# Altium project SC945D.PrjPcb (part 1 of 2)
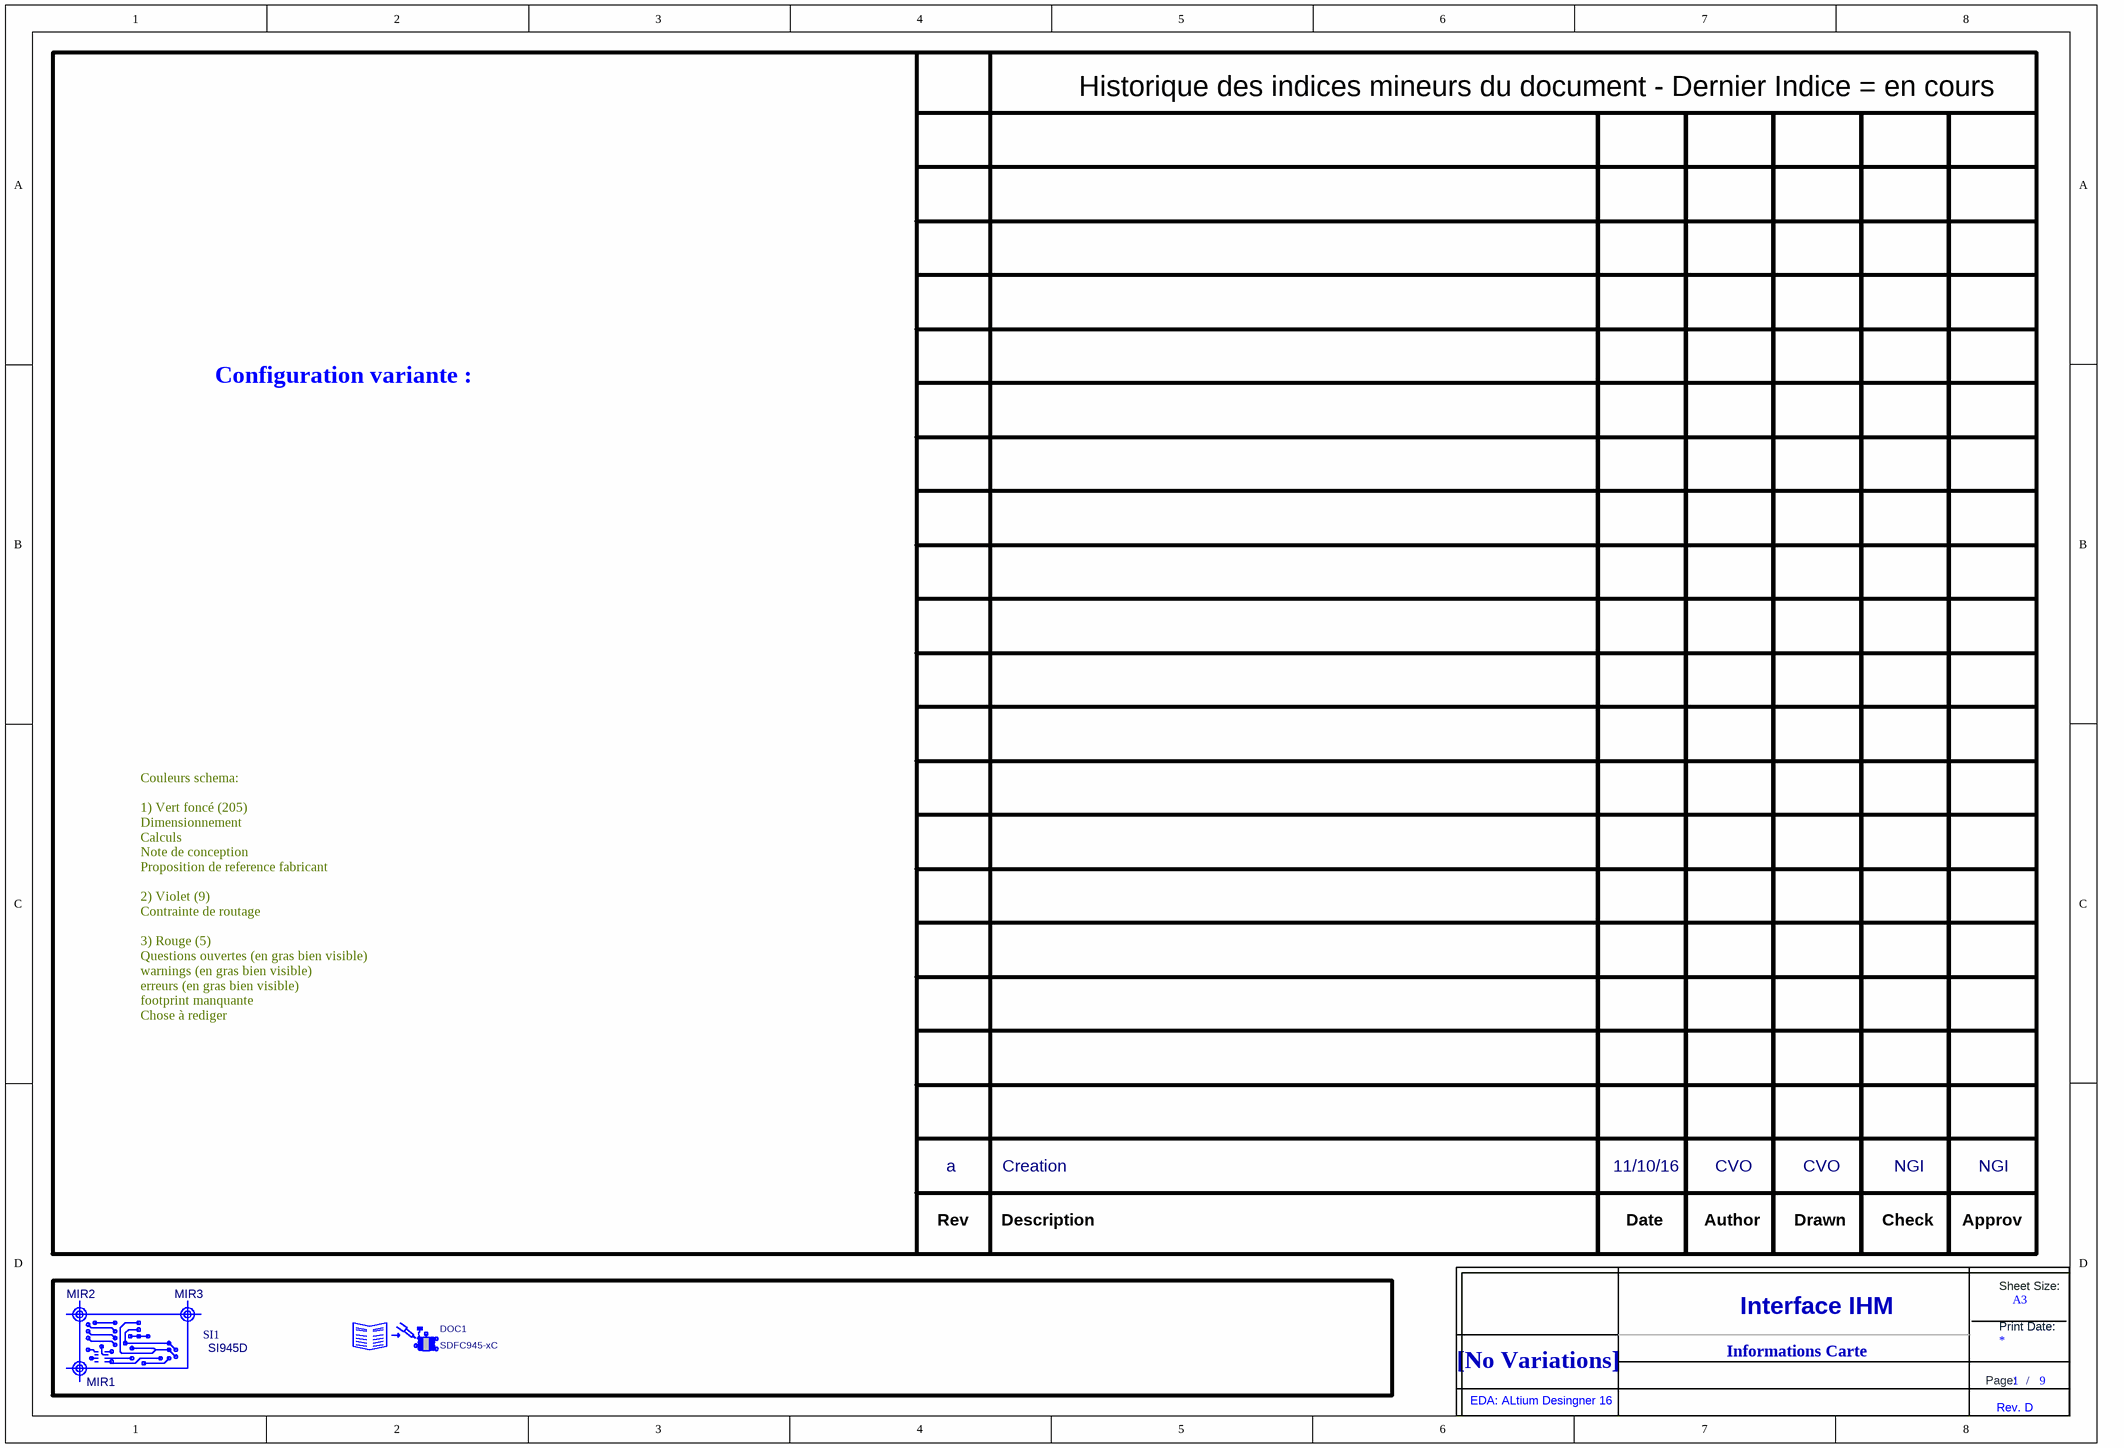
[diagram p0: SC945D_Sommaire.SchDoc]
_Instructions_SC: Les dates et versions mineurs du SDEC (SC) sont à remplir sur la page ..._infos.doc; _Instructions_SI: Les dates et versions mineurs du SI sont à remplir dans la couche "Cartouche TOP"; prjPcbTitle0: Interface IHM; refSI: SI945D; SDECSheetSize: A3; SISheetSize: A3
9 sheets, 180 parts. Net scope: flat (ports and power ports of the same name join across sheets).
Board file: SI945D.PCBDOC
Sheets:
  SC945D_Sommaire.SchDoc
  SC945D_Interface_BP_et_Prog.SchDoc
  SC945D_Alimentations.SchDoc
  SC945D_Micro.SchDoc
  SC945D_SD_Card.SchDoc
  SC945D_Audio.SchDoc
  SC945D_Touchscreen.SchDoc
  SC945D_Backlight.SchDoc
  SC945D_Afficheur.SchDoc

## Sheet SC945D_Sommaire.SchDoc: Informations Carte
size 393 x 270 mm; CompanyName: Seccom; Address1: 521, rue du capt. François Garbit; Address2: 69440 Mornant; Address3: seccom@seccom.fr; Address4: www.seccom.fr; DocumentNumber: 1; SheetNumber: 1; SheetTotal: 9; PageSetup: Record=PageOptions|CenterHorizontal=True|CenterVertical=True|PrintScale=0.74|XCorrection=1.00|YCorrection=1.00|PrintKind=0|BorderSize=5000000|LeftOffset=0|BottomOffset=0|Orientation=2|PaperLength=1000|PaperWidth=1000|Scale=100|PaperSource=7|PrintQuality=-4|MediaType=1|DitherType=10|PaperKind=A4|PrintScaleMode=1

### Parts
(Parts that share a designator on the sheet are numbered #1, #2 ... from top to bottom, then left to right.)
DOC1  Reference: SDFC945-xC  [NULL]  (hidden comment: DOCUMENT_FAB_CARTE_SDFC)
MIR1  MIRE_PICK-N-PLACE  [MIRE_PICK-N-PLACE_D1MM_VE3MM]  (value not drawn)
MIR2  MIRE_PICK-N-PLACE  [MIRE_PICK-N-PLACE_D1MM_VE3MM]  (value not drawn)
MIR3  MIRE_PICK-N-PLACE  [MIRE_PICK-N-PLACE_D1MM_VE3MM]  (value not drawn)
SI1  Reference: SI945D  [CIRCUIT_IMPRIME_SI_STD]
Title_new?#1  DNI  (value not drawn)  (graphical)

### Notes on the sheet
- Historique des indices mineurs du document - Dernier Indice = en cours
- Configuration variante :
- Couleurs schema:
  1) Vert foncé (205)
  Dimensionnement
  Calculs
  Note de conception
  Proposition de reference fabricant
  2) Violet (9)
  Contrainte de routage
  3) Rouge (5)
  Questions ouvertes (en gras bien visible)
  warnings (en gras bien visible)
  erreurs (en gras bien visible)
  footprint manquante
  Chose à rediger
- a
- Creation
- 11/10/16
- CVO
- NGI
- Rev
- Description
- Date
- Author
- Drawn
- Check
- Approv
- Informations Carte
- (in symbol Title_new) Sheet Size:; A3; Interface IHM; Print Date:; [No Variations]; Page:; /; EDA: ALtium Desingner 16; Rev. D

### Library data of the parts
DOC1 = DOCUMENT_FAB_CARTE_SDFC: Document de Fabrication pour la Carte SC{Num SC}-{Version SC}; Creation: LJ; Coeff: 0; Verification: *; Boitier: *; Fabricant: *; Ref Fab: *; Config: *; ComponentLink1URL: http://192.168.0.202/index.php/Accueil; ComponentLink2URL: http://192.168.0.202/index.php/Accueil; ComponentLink1Description: Datasheet; ComponentLink2Description: Datasheet Boitier
MIR1-MIR3 = MIRE_PICK-N-PLACE: Mire pour machine de placement CMS "Pick'n Place"; Creation: LJ (25/10/12); Config: NC; Coeff: 0; Value: *
SI1 = CIRCUIT_IMPRIME_MODEL: Circuit Imprimé; Value: SI945D; Creation: LJ; Verification: LJ (15/11/04); Remarque: {Remarque}; Fabricant: Valentinea; Coeff: 1; Boitier: *; Ref Fab: SI945D; ComponentLink1URL: \\SRV_backup\datasheet\; ComponentLink2URL: \\SRV_backup\datasheet\_BOITIERS\; Config: *; ComponentLink1Description: Datasheet; ComponentLink2Description: Datasheet Boitier
Title_new?#1 = Title_new

## Sheet SC945D_Interface_BP_et_Prog.SchDoc: Interface Boitier Principal & Programmation
size 393 x 270 mm; CompanyName: Seccom; Address1: 521, rue du capt. François Garbit; Address2: 69440 Mornant; Address3: seccom@seccom.fr; Address4: www.seccom.fr; DocumentNumber: 2; SheetNumber: 2; SheetTotal: 9; PageSetup: Record=PageOptions|CenterHorizontal=True|CenterVertical=True|PrintScale=0.74|XCorrection=1.00|YCorrection=1.00|PrintKind=0|BorderSize=5000000|LeftOffset=0|BottomOffset=0|Orientation=2|PaperLength=1000|PaperWidth=1000|Scale=100|PaperSource=7|PrintQuality=-4|MediaType=1|DitherType=10|PaperKind=A4|PrintScaleMode=1
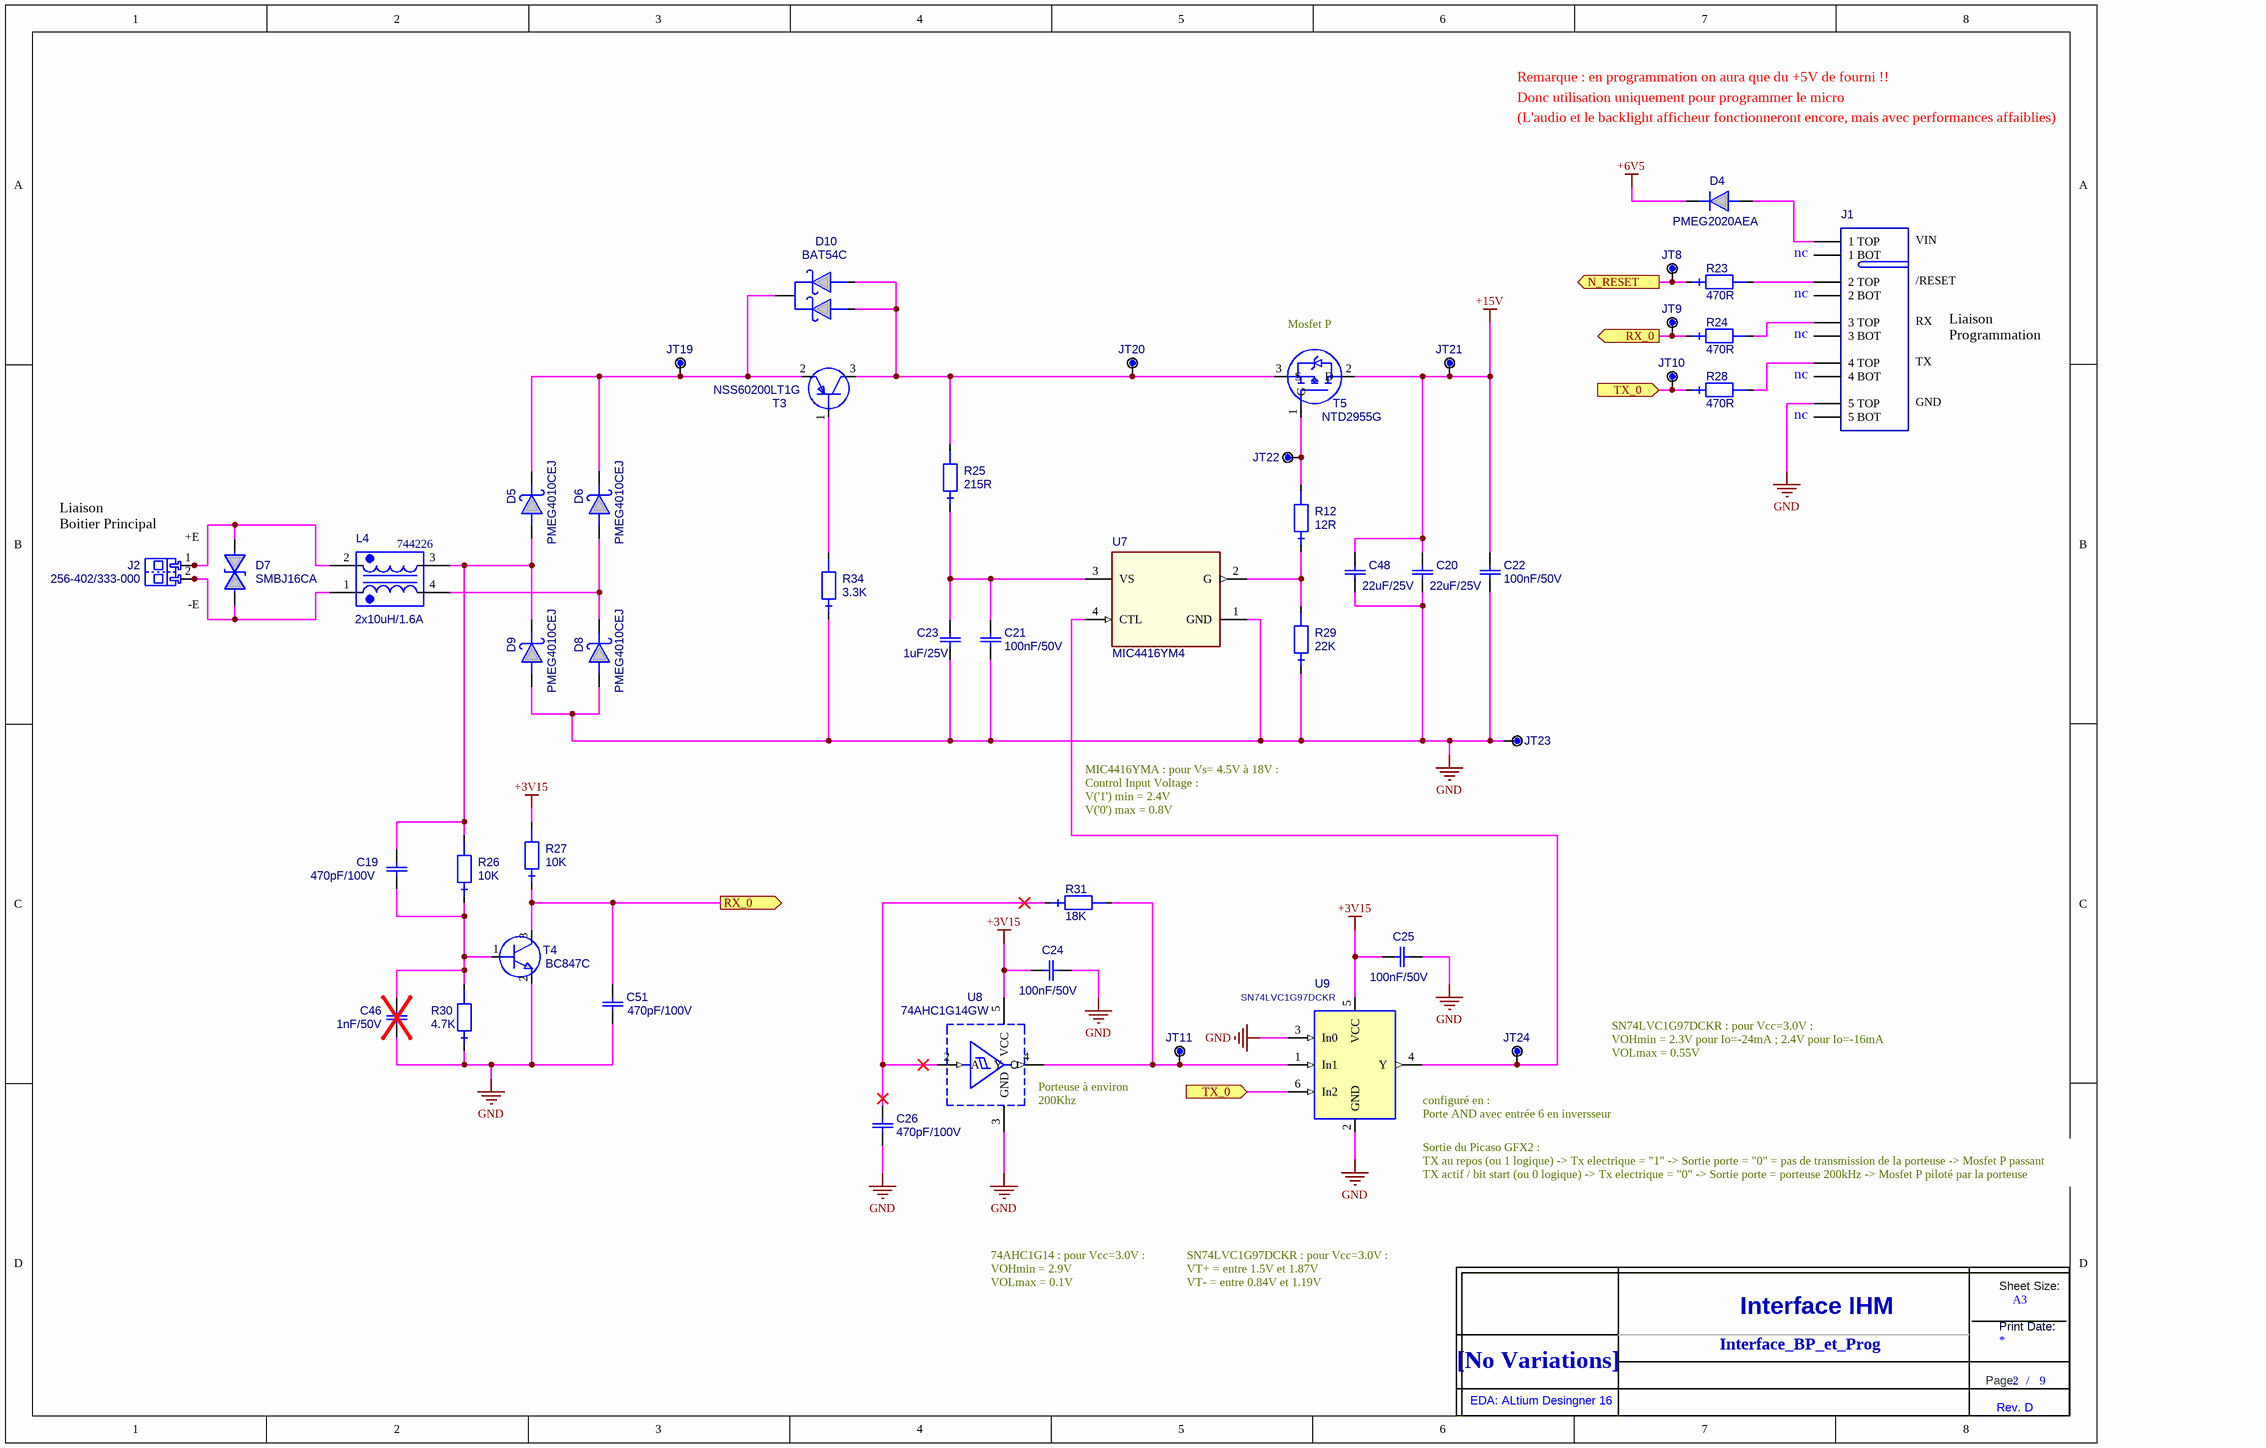
[diagram p1: SC945D_Interface_BP_et_Prog.SchDoc]

### Parts
(Parts that share a designator on the sheet are numbered #1, #2 ... from top to bottom, then left to right.)
C19  value 470pF/100V  [0805_ReflowSoldering_CAP]  (hidden comment: C_0805_NPO_5%_470P-100V)
C20  value 22uF/25V  [1206_ReflowSoldering_CAP]  (hidden comment: C_1206_X5R_20%_22U-25V)
C21  value 100nF/50V  [0603_ReflowSoldering_CAP]  (hidden comment: C_0603_X7R_10%_100N-50V)
C22  value 100nF/50V  [0603_ReflowSoldering_CAP]  (hidden comment: C_0603_X7R_10%_100N-50V)
C23  value 1uF/25V  [0805_ReflowSoldering_CAP]  (hidden comment: C_0805_X5R_10%_1U-25V)
C24  value 100nF/50V  [0603_ReflowSoldering_CAP]  (hidden comment: C_0603_X7R_10%_100N-50V)
C25  value 100nF/50V  [0603_ReflowSoldering_CAP]  (hidden comment: C_0603_X7R_10%_100N-50V)
C26  value 470pF/100V  [0805_ReflowSoldering_CAP]  (hidden comment: C_0805_NPO_5%_470P-100V)
C46  value 1nF/50V  [0603_ReflowSoldering_CAP]  (hidden comment: C_0603_NPO_5%_1N-50V)  (no BOM)
C48  value 22uF/25V  [1206_ReflowSoldering_CAP]  (hidden comment: C_1206_X5R_20%_22U-25V)
C51  value 470pF/100V  [0805_ReflowSoldering_CAP]  (hidden comment: C_0805_NPO_5%_470P-100V)
D4  PMEG2020AEA  [SOD323_ReflowSoldering]
D5  PMEG4010CEJ  [SOD323_ReflowSoldering]
D6  PMEG4010CEJ  [SOD323_ReflowSoldering]
D7  SMBJ16CA  [DO214AA-SMB-NP_ReflowSoldering]
D8  PMEG4010CEJ  [SOD323_ReflowSoldering]
D9  PMEG4010CEJ  [SOD323_ReflowSoldering]
D10  BAT54C  [SOT23_3L_ReflowSoldering]
J1  EMB_ZEC_1893711_HOTE  [EMB_ZEC_1893711_HOTE_NOBOTT]  (value not drawn)  (no BOM)
J2  value 256-402/333-000  [BVIS_02_WAGO_256-402/333-000]  (hidden comment: BLEV_CI_45D_5.08_02_256-402/333-000)
JT8  POINT_TEST_PAD_40MIL  [PAD_CMS_40X40_E]  (value not drawn)  (no BOM)
JT9  POINT_TEST_PAD_40MIL  [PAD_CMS_40X40_E]  (value not drawn)  (no BOM)
JT10  POINT_TEST_PAD_40MIL  [PAD_CMS_40X40_E]  (value not drawn)  (no BOM)
JT11  POINT_TEST_PAD_40MIL  [PAD_CMS_40X40_E]  (value not drawn)  (no BOM)
JT19  POINT_TEST_PAD_40MIL  [PAD_CMS_40X40_E]  (value not drawn)  (no BOM)
JT20  POINT_TEST_PAD_40MIL  [PAD_CMS_40X40_E]  (value not drawn)  (no BOM)
JT21  POINT_TEST_PAD_40MIL  [PAD_CMS_40X40_E]  (value not drawn)  (no BOM)
JT22  POINT_TEST_PAD_40MIL  [PAD_CMS_40X40_E]  (value not drawn)  (no BOM)
JT23  POINT_TEST_PAD_40MIL  [PAD_CMS_40X40_E]  (value not drawn)  (no BOM)
JT24  POINT_TEST_PAD_40MIL  [PAD_CMS_40X40_E]  (value not drawn)  (no BOM)
L4  value 2x10uH/1.6A  Ref Fab: 744226  [SELF_WE-SL2_9.2x6]  (hidden comment: IND_FERRITE_WE-SL2_2X10UH)
R12  value 12R  [0603_ReflowSoldering_RES]  (hidden comment: RES_0603_1%_100PPM_12R)
R23  value 470R  [0603_ReflowSoldering_RES]  (hidden comment: RES_0603_1%_100PPM_470R)
R24  value 470R  [0603_ReflowSoldering_RES]  (hidden comment: RES_0603_1%_100PPM_470R)
R25  value 215R  [0603_ReflowSoldering_RES]  (hidden comment: RES_0603_1%_100PPM_215R)
R26  value 10K  [0603_ReflowSoldering_RES]  (hidden comment: RES_0603_1%_100PPM_10K)
R27  value 10K  [0603_ReflowSoldering_RES]  (hidden comment: RES_0603_1%_100PPM_10K)
R28  value 470R  [0603_ReflowSoldering_RES]  (hidden comment: RES_0603_1%_100PPM_470R)
R29  value 22K  [0603_ReflowSoldering_RES]  (hidden comment: RES_0603_1%_100PPM_22K)
R30  value 4.7K  [0603_ReflowSoldering_RES]  (hidden comment: RES_0603_1%_100PPM_4.7K)
R31  value 18K  [0603_ReflowSoldering_RES]  (hidden comment: RES_0603_1%_100PPM_18K)
R34  value 3.3K  [0603_ReflowSoldering_RES]  (hidden comment: RES_0603_1%_100PPM_3.3K)
T3  NSS60200LT1G  [SOT23_3L_ReflowSoldering]
T4  BC847C  [SOT23_3L_ReflowSoldering]
T5  NTD2955G  [DPAK]
Title_new?#2  DNI  (value not drawn)  (graphical)
U7  MIC4416YM4  [SOT143]
U8  74AHC1G14GW  [SOT353]
U9  value SN74LVC1G97DCKR  [SC70_6]  (hidden comment: 74LVC1G97DCKR)

### Ports
N_RESET (out), RX_0 (out), TX_0 (in)

### Nets
+3V15: C24.2 C25.2 R27.2 U8.5(VCC) U9.5(VCC)
+6V5: D4.K
+15V: C20.2 C22.2 C48.2 JT21.1 T5.2(D)
GND: C20.1 C21.1 C22.1 C23.1 C24.1 C25.1 C26.1 C46.1 C48.1 C51.1 D8.A D9.A J1.5(5_TOP) JT23.1 R29.1 R30.1 R34.1 T4.2(E) U7.1(GND) U8.3(GND) U9.2(GND) U9.3(In0)
N_RESET: JT8.1 R23.1 ; port N_RESET
RX_0: C51.2 JT9.1 R24.1 R27.1 T4.3(C) ; port RX_0
TX_0: JT10.1 R28.1 U9.6(In2) ; port TX_0
NetC19_1: C19.1 C46.2 R26.1 R30.2 T4.1(B)
NetC19_2: C19.2 D5.A D9.K L4.3 R26.2
NetC21_2: C21.2 C23.2 R25.1 U7.3(VS)
NetC26_2: C26.2 R31.1 U8.2(A)
NetD4_A: D4.A J1.1(1_TOP)
NetD5_K: D5.K D6.K D10.3 JT19.1 T3.2(E)
NetD6_A: D6.A D8.K L4.4
NetD7_1: D7.1 J2.2 J2.4 L4.1
NetD7_2: D7.2 J2.1 J2.3 L4.2
NetD10_1: D10.1 D10.2 JT20.1 R25.2 T3.3(C) T5.3(S)
NetJ1_2: J1.2(2_TOP) R23.2
NetJ1_3: J1.3(3_TOP) R24.2
NetJ1_4: J1.4(4_TOP) R28.2
NetJT11_1: JT11.1 R31.2 U8.4(Y) U9.1(In1)
NetJT22_1: JT22.1 R12.2 T5.1(G)
NetJT24_1: JT24.1 U7.4(CTL) U9.4(Y)
NetR12_1: R12.1 R29.2 U7.2(G)
NetR34_2: R34.2 T3.1(B)

Not connected (* = marked no-connect by the designer): J1 6(1_BOT) 7(2_BOT) 8(3_BOT) 9(4_BOT) 10(5_BOT); U8 1

### Notes on the sheet
- Remarque : en programmation on aura que du +5V de fourni !!
- Donc utilisation uniquement pour programmer le micro
- (L'audio et le backlight afficheur fonctionneront encore, mais avec performances affaiblies)
- (near J1) nc
- VIN
- /RESET
- (near T5) Mosfet P
- RX
- TX
- Liaison Programmation
- GND
- (near J2) Liaison
  Boitier Principal
- +E
- -E
- MIC4416YMA : pour Vs= 4.5V à 18V :
  Control Input Voltage :
  V('1') min = 2.4V
  V('0') max = 0.8V
- SN74LVC1G97DCKR : pour Vcc=3.0V :
  VOHmin = 2.3V pour Io=-24mA ; 2.4V pour Io=-16mA
  VOLmax = 0.55V
- (near U8) Porteuse à environ 200Khz
- configuré en :
  Porte AND avec entrée 6 en inversseur
- (near U9) Sortie du Picaso GFX2 :
  TX au repos (ou 1 logique) -> Tx electrique = "1" -> Sortie porte = "0" = pas de transmission de la porteuse -> Mosfet P passant
  TX actif / bit start (ou 0 logique) -> Tx electrique = "0" -> Sortie porte = porteuse 200kHz -> Mosfet P piloté par la porteuse
- 74AHC1G14 : pour Vcc=3.0V :
  VOHmin = 2.9V
  VOLmax = 0.1V
- SN74LVC1G97DCKR : pour Vcc=3.0V :
  VT+ = entre 1.5V et 1.87V
  VT- = entre 0.84V et 1.19V
- Interface_BP_et_Prog
- (in symbol Title_new) Sheet Size:; A3; Interface IHM; Print Date:; [No Variations]; Page:; /; EDA: ALtium Desingner 16; Rev. D

### Library data of the parts
C19 C26 C51 = C_0805_NPO_5%_470P-100V: Condensateur céramique, NPO, 5%, CMS 0805; Creation: EC (30/04/10); Verification: LJ (20/05/10); Reference: 001384/00; Boitier: 0805; Remarque: {Remarque}; Coeff: 1; Fabricant: AVX; Ref Fab: 08051A471JAT2A; ComponentLink1URL: o:\_Documentation\Datasheets\BC_Components\Condo_CMS_NPO-X7R-Y5V.pdf; ComponentLink2URL: o:\_Documentation\Datasheets\_BOITIERS\PASSIF_CMS\RC_0805_(2x1,25)_(Schneider).PDF; Config: *; ComponentLink1Description: Datasheet; ComponentLink2Description: Datasheet Boitier; Supplier 1: Farnell; Supplier 2: Mouser; Supplier Part Number 1: 499195; Supplier Part Number 2: 581-08051A471J
C20 C48 = C_1206_X5R_20%_22U-25V: Condensateur céramique, X5R, 20%, CMS 1206, 22uF/25V; Creation: ZA (18/12/13); Reference: /01; Boitier: 1206; Remarque: {Remarque}; Coeff: 1; Fabricant: TDK; Ref Fab: C3216X5R1E226M160AB; Verification: *; ComponentLink1URL: O:\_Documentation\Datasheets\TDK\general_B11.pdf; ComponentLink2URL: o:\_Documentation\Datasheets\_BOITIERS\PASSIF_CMS\; ComponentLink1Description: Datasheet; ComponentLink2Description: Datasheet Boitier; Supplier 1: Farnell; Supplier Part Number 1: 2354129; Supplier 2: Mouser; Supplier Part Number 2: 810-C3216X5R1E226M
C21 C22 C24 C25 = C_0603_X7R_10%_100N-50V: Condensateur céramique, X7R, 10%, CMS 0603, 100nF/50V; Creation: FB (29/02/12); Boitier: 0603; Remarque: {Remarque}; Fabricant: Kemet; Ref Fab: C0603C104K5RAC; Coeff: 1; ComponentLink1URL: O:\_Documentation\Datasheets\Kemet\Condos_Ceramic_CMS.pdf; ComponentLink2URL: o:\_Documentation\Datasheets\_BOITIERS\PASSIF_CMS\; Config: *; ComponentLink1Description: Datasheet; ComponentLink2Description: Datasheet Boitier; Supplier 1: Farnell; Supplier Part Number 1: 1288255
C23 = C_0805_X5R_10%_1U-25V: Condensateur céramique, X5R, 10%, CMS 0805; Creation: FB (07/03/12); Reference: 001834/00; Boitier: 0805; Remarque: {Remarque}; Coeff: 1; Fabricant: AVX; Ref Fab: 08053D105KAT2A; Verification: *; ComponentLink1URL: O:\_Documentation\Datasheets\AVX\Condensateurs_CMS_Ceramic_X5R.pdf; ComponentLink2URL: o:\_Documentation\Datasheets\_Boitiers\PASSIF_CMS\RC_0805_(2x1,25)_(Schneider).pdf; Config: *; ComponentLink1Description: Datasheet; ComponentLink2Description: Datasheet Boitier; Supplier Part Number 1: 1327695; Supplier Part Number 2: 6983409; Supplier 1: Farnell; Supplier 2: Radiospares
C46 = C_0603_NPO_5%_1N-50V: Condensateur céramique, NPO, 5%, CMS 0603; Creation: LJ; Reference: 001809/00; Boitier: 0603; Remarque: {Remarque}; Coeff: 1; Fabricant: AVX; Ref Fab: 06035A102JAT2A; ComponentLink1URL: o:\_Documentation\Datasheets\BC_Components\Condo_CMS_NPO-X7R-Y5V.pdf; ComponentLink2URL: o:\_Documentation\Datasheets\_BOITIERS\PASSIF_CMS\; Config: *; ComponentLink1Description: Datasheet; ComponentLink2Description: Datasheet Boitier; Supplier 1: Mouser; Supplier Part Number 1: 581-06035A102J
D4 = PMEG2020AEA: Diode Schottky, Vrrm=20V, If=2A, Vf=0.45V, CMS; Creation: PDP (10/07/12); Boitier: SOD323; Remarque: {Remarque}; Coeff: 1; Fabricant: NXP; Verification: *; ComponentLink1URL: o:\_Documentation\Datasheets\NXP\PMEG2020AEA.PDF; ComponentLink2URL: o:\_Documentation\Datasheets\_BOITIERS\ACTIF_CMS\SOD\SOD_80_(MLL34)_(Schneider).PDF; Config: *; ComponentLink1Description: Datasheet; ComponentLink2Description: Datasheet Boitier; Ref Fab: PMEG2020AEA; Value: PMEG2020AEA
D5 D6 D8 D9 = PMEG4010CEJ: Diode Schottky, Vrrm=40V, If=1A, Vf=0.49V, CMS, -65/+150°C; Creation: FB (30/07/13); Boitier: SOD323F; Remarque: {Remarque}; Coeff: 1; Fabricant: NXP; Verification: *; ComponentLink1URL: O:\_Documentation\Datasheets\NXP\PMEG4010CEH_PMEG4010CEJ.pdf; Config: *; ComponentLink1Description: Datasheet; ComponentLink2Description: Datasheet Boitier; Ref Fab: PMEG4010CEJ; Value: PMEG4010CEJ; Supplier 1: Farnell; Supplier Part Number 1: 1757777; Supplier 2: Mouser; Supplier Part Number 2: 771-PMEG4010CEJ-T/R
D7 = SMBJ16CA: Diode Transil/TVS bidirectionnelle (CA), 600W, 16V, CMS, serie SMBJ; Creation: FB (30/07/13); Boitier: DO214AA/SMB; Remarque: {Remarque}; Coeff: 1; Fabricant: Bourns; ComponentLink1URL: O:\_Documentation\Datasheets\Bourns\SMBJ_diodes_TVS_600W.pdf; ComponentLink2URL: o:\_Documentation\Datasheets\_BOITIERS\ACTIF_CMS\SMx\SMB_(Schneider).lnk; Config: *; ComponentLink1Description: Datasheet; ComponentLink2Description: Datasheet Boitier; Ref Fab: SMBJ16CA; Supplier Part Number 1: 652-SMBJ16CA; Supplier 1: Mouser; Value: SMBJ16CA
D10 = BAT54C: Diode Schottky double, BAT54 cathode com, Vrrm=30V, If=300mA, Vf=0.4Vmax, CMS; Creation: LJ (14/05/02); Reference: 000597/00; Boitier: SOT23_3L; Remarque: {Remarque}; Coeff: 1; Fabricant: NXP; Verification: LJ (14/05/02); ComponentLink1URL: O:\_Documentation\Datasheets\NXP\BAT54_series.pdf; ComponentLink2URL: o:\_Documentation\Datasheets\_BOITIERS\ACTIF_CMS\SOT\SOT_23_3P_(Schneider).PDF; Config: *; ComponentLink1Description: Datasheet; ComponentLink2Description: Datasheet Boitier; Ref Fab: BAT54C; Supplier 1: Farnell; Supplier Part Number 1: 1081192; Value: BAT54C
J1 = EMB_ZEC_1893711_HOTE: Implantation CI pour connecteur ZEC 1,0/5-ST-3,5 C1 R1,5 (ref 1893711); Creation: JPL (18/07/12); Fabricant: Phoenix Contact; Coeff: 1; Config: *; ComponentLink1Description: Datasheet; ComponentLink2Description: Datasheet Boitier
J2 = BLEV_CI_45D_5.08_02_256-402/333-000: Bornier à levier pour CI, e5.08, 2pts, 45 degrés, 300V/15A, AWG 28-12, Gris; Creation: LJ; Remarque: {Remarque}; Fabricant: Wago; Coeff: 1; Ref Fab: 256-402/333-000; Config: *; ComponentLink1Description: Datasheet; ComponentLink2Description: Datasheet; Supplier 1: Farnell; Supplier Part Number 1: 1695013
JT8-JT11 JT19-JT24 = POINT_TEST_PAD_40MIL: Point de test sur CI, pad de diamètre 1.016mm (40mils); Creation: FB (04/10/12); Remarque: {Remarque}; Coeff: 1; Value: POINT_TEST; Config: *; ComponentLink1Description: Datasheet; ComponentLink2Description: Datasheet Boitier
L4 = IND_FERRITE_WE-SL2_2X10UH: Filtre double ferrite, 2x10uH, 42Vac/80Vdc, 1.6A, serie WE-SL2, -40/+125°C, CMS; Creation: FB (19/03/12); Boitier: WE-SL2_9.2x6_h5mm; Coeff: 1; Fabricant: Wurth Elektronik; ComponentLink1URL: O:\_Documentation\Datasheets\Wurth_Elektronik\744226.pdf; ComponentLink2URL: o:\_Documentation\Datasheets\_BOITIERS\; Config: *; ComponentLink1Description: Datasheet; ComponentLink2Description: Datasheet Boitier; Supplier Part Number 1: 1636269; Supplier 1: Farnell; Supplier 2: Radiospares; Supplier Part Number 2: 3675045
R12 = RES_0603_1%_100PPM_12R: Résistance, 0.100W, 1%, 100ppm, 75V, 12R; Creation: FB (11/09/12); Boitier: 0603; Remarque: {Remarque}; Fabricant: Vishay; Ref Fab: CRCW060312R0FKEA; Coeff: 1; Verification: *; ComponentLink1URL: O:\_Documentation\Datasheets\Vishay\Resistances_D-CRCWe3.pdf; ComponentLink2URL: o:\_Documentation\Datasheets\_BOITIERS\PASSIF_CMS\; Config: *; ComponentLink1Description: Datasheet; ComponentLink2Description: Datasheet Boitier; Supplier 1: Farnell; Supplier Part Number 1: 1652838; Supplier 2: Mouser; Supplier Part Number 2: 71-CRCW0603-12-E3
R23 R24 R28 = RES_0603_1%_100PPM_470R: Résistance, 0.100W, 1%, 100ppm, 75V, 470R; Creation: FB (29/07/13); Boitier: 0603; Remarque: {Remarque}; Fabricant: Vishay; Ref Fab: CRCW0603470RFKEA; Coeff: 1; Verification: *; ComponentLink1URL: O:\_Documentation\Datasheets\Vishay\Resistances_D-CRCWe3.pdf; ComponentLink2URL: o:\_Documentation\Datasheets\_BOITIERS\PASSIF_CMS\; Config: *; ComponentLink1Description: Datasheet; ComponentLink2Description: Datasheet Boitier; Supplier 1: Farnell; Supplier Part Number 1: 1469815; Supplier 2: Mouser; Supplier Part Number 2: 71-CRCW0603-470-E3
R25 = RES_0603_1%_100PPM_215R: Résistance, 0.100W, 1%, 100ppm, 75V, 215R; Creation: FB (05/03/12); Boitier: 0603; Remarque: {Remarque}; Fabricant: Vishay; Ref Fab: CRCW0603215RFKEA; Coeff: 1; Verification: *; ComponentLink1URL: O:\_Documentation\Datasheets\Vishay\Resistances_D-CRCWe3.pdf; ComponentLink2URL: o:\_Documentation\Datasheets\_BOITIERS\PASSIF_CMS\; Config: *; ComponentLink1Description: Datasheet; ComponentLink2Description: Datasheet Boitier; Supplier 1: Farnell; Supplier 2: RadioSpares; Supplier Part Number 1: 1252503; Supplier Part Number 2: 6789976
R26 R27 = RES_0603_1%_100PPM_10K: Résistance, 0.100W, 1%, 100ppm, 75V, 10K; Creation: JPL (05/07/12); Boitier: 0603; Remarque: {Remarque}; Fabricant: Vishay; Ref Fab: CRCW060310K0FKEA; Coeff: 1; Verification: *; ComponentLink1URL: O:\_Documentation\Datasheets\Vishay\Resistances_D-CRCWe3.pdf; ComponentLink2URL: o:\_Documentation\Datasheets\_BOITIERS\PASSIF_CMS\; Config: *; ComponentLink1Description: Datasheet; ComponentLink2Description: Datasheet Boitier; Supplier 1: Farnell; Supplier 2: RadioSpares; Supplier Part Number 1: 1469748; Supplier Part Number 2: 6789667
R29 = RES_0603_1%_100PPM_22K: Résistance, 0.100W, 1%, 100ppm, 75V, 22K; Creation: JPL (05/07/12); Boitier: 0603; Remarque: {Remarque}; Fabricant: Vishay; Ref Fab: CRCW060322K0FKEA; Coeff: 1; Verification: *; ComponentLink1URL: O:\_Documentation\Datasheets\Vishay\Resistances_D-CRCWe3.pdf; ComponentLink2URL: o:\_Documentation\Datasheets\_BOITIERS\PASSIF_CMS\; Config: *; ComponentLink1Description: Datasheet; ComponentLink2Description: Datasheet Boitier; Supplier 1: Farnell; Supplier 2: RadioSpares; Supplier Part Number 1: 1469779; Supplier Part Number 2: 6790005
R30 = RES_0603_1%_100PPM_4.7K: Résistance, 0.100W, 1%, 100ppm, 75V, 4.7K; Creation: JPL (05/07/12); Boitier: 0603; Remarque: {Remarque}; Fabricant: Vishay; Ref Fab: CRCW06034K70FKEA; Coeff: 1; Verification: *; ComponentLink1URL: O:\_Documentation\Datasheets\Vishay\Resistances_D-CRCWe3.pdf; ComponentLink2URL: o:\_Documentation\Datasheets\_BOITIERS\PASSIF_CMS\; Config: *; ComponentLink1Description: Datasheet; ComponentLink2Description: Datasheet Boitier; Supplier 1: Farnell; Supplier 2: RadioSpares; Supplier Part Number 1: 1469807; Supplier Part Number 2: 6790484
R31 = RES_0603_1%_100PPM_18K: Résistance, 0.100W, 1%, 100ppm, 75V, 18K; Creation: JPL (05/07/12); Boitier: 0603; Remarque: {Remarque}; Fabricant: Vishay; Ref Fab: CRCW060318K0FKEA; Coeff: 1; Verification: *; ComponentLink1URL: O:\_Documentation\Datasheets\Vishay\Resistances_D-CRCWe3.pdf; ComponentLink2URL: o:\_Documentation\Datasheets\_BOITIERS\PASSIF_CMS\; Config: *; ComponentLink1Description: Datasheet; ComponentLink2Description: Datasheet Boitier; Supplier 1: Farnell; Supplier 2: RadioSpares; Supplier Part Number 1: 1692519; Supplier Part Number 2: 6789857
R34 = RES_0603_1%_100PPM_3.3K: Résistance, 0.100W, 1%, 100ppm, 75V, 3.3K; Creation: PDP (19/09/12); Boitier: 0603; Remarque: {Remarque}; Fabricant: Vishay; Ref Fab: CRCW06033K30FKEA; Coeff: 1; Verification: *; ComponentLink1URL: O:\_Documentation\Datasheets\Vishay\Resistances_D-CRCWe3.pdf; ComponentLink2URL: o:\_Documentation\Datasheets\_BOITIERS\PASSIF_CMS\; Config: *; ComponentLink1Description: Datasheet; ComponentLink2Description: Datasheet Boitier; Supplier 1: Mouser; Supplier Part Number 1: 71-CRCW0603-3.3K-E3
T3 = NSS60200LT1G: Transistor PNP, Vce=-60V, Ic=-4A, Rdson 0.080r, -55 à 150°C, CMS; Creation: ZA (18/12/13); Reference: /01; Boitier: SOT23_3L; Remarque: {Remarque}; Coeff: 1; Fabricant: ON Semi; Verification: *; ComponentLink1URL: o:\_Documentation\Datasheets\ON_Semiconductors\NSS60200L-D.PDF; ComponentLink2URL: o:\_Documentation\Datasheets\ON_Semiconductors\NSS60200L-D.PDF; Config: *; ComponentLink1Description: Datasheet; Ref Fab: NSS60200LT1G; ComponentLink2Description: Datasheet Boitier; Supplier 1: Farnell; Supplier Part Number 1: 2317570; Supplier 2: Mouser; Supplier Part Number 2: 863-NSS60200LT1G; Value: NSS60200LT1G
T4 = BC847C: Transistor NPN, Vce=50V, Ic=0.1A, hfe=420~800, 0.25W, CMS; Creation: GO (08/07/05); Verification: LJ (21/07/05); Reference: 000329/00; Boitier: SOT23_3L; Remarque: Complementaires aux BC856-860; Coeff: 1; Fabricant: NXP; ComponentLink1URL: O:\_Documentation\Datasheets\NXP\BC847.pdf; ComponentLink2URL: o:\_Documentation\Datasheets\_BOITIERS\ACTIF_CMS\SOT\SOT_23_3P_(Schneider).PDF; Config: *; ComponentLink1Description: Datasheet; Value: BC847C; Supplier 1: Farnell; Supplier Part Number 1: 1081235; Ref Fab: BC847C; ComponentLink2Description: Datasheet Boitier
T5 = NTD2955G: Transistor Mosfet P, Vdss=60V, Id=12A, Rdson=0.155R, -55/+175°C, CMS; Creation: PDP (13/07/12); Coeff: 1; Fabricant: ON Semiconductor; Boitier: DPAK; Verification: *; ComponentLink1URL: O:\_Documentation\Datasheets\ON_Semiconductors\NTD2955.PDF; ComponentLink2URL: o:\_Documentation\Datasheets\_BOITIERS\ACTIF_CMS\; Config: *; ComponentLink1Description: Datasheet; Ref Fab: NTD2955G; Supplier 1: Farnell; Supplier Part Number 1: 2101431; Supplier 2: Mouser; Supplier Part Number 2: 863-NTD2955G; ComponentLink2Description: Datasheet Boitier; Value: NTD2955G
Title_new?#2 = Title_new
U7 = MIC4416YM4: Low side MOSFET Driver ,+4.5V to +18V,1.2A peak, non-inverting, -40/+85°C, CMS; Creation: CHD (21/02/12); Verification: FB (11/09/12); Fabricant: Micrel; Coeff: 1; Boitier: SOT143; Ref Fab: MIC4416YM4; ComponentLink1URL: O:\_Documentation\Datasheets\Micrel\MIC4416_4417.pdf; Config: *; ComponentLink1Description: Datasheet; ComponentLink2Description: Datasheet Boitier; Supplier 1: Farnell; Supplier Part Number 1: 1100664; Value: MIC4416YM4
U8 = 74AHC1G14GW: Inverseur simple, Trigger de Schmitt, AHC, Picogate, CMS; Creation: LJ (25/06/09); Reference: 000742/00; Remarque: {Remarque}; Coeff: 1; Fabricant: NXP; Verification: *; Boitier: SOT353; ComponentLink1URL: o:\_Documentation\Datasheets\NXP\74AHC1G14-74AHCT1G14.pdf; ComponentLink2URL: o:\_Documentation\Datasheets\_BOITIERS\ACTIF_CMS\SOT\SOT_23_5P_(Schneider).pdf; Config: *; ComponentLink1Description: Datasheet; ComponentLink2Description: Datasheet Boitier; Supplier 1: Farnell; Supplier Part Number 1: 1085241; Value: 74AHC1G14GW; Ref Fab: 74AHC1G14GW
U9 = 74LVC1G97DCKR: Porte logique multifonction, AND/OR/NAND/NOR/INV/BUFFER, LVC, CMS SC70_6; Creation: LJ (01/08/08); Reference: 000193/00; Remarque: {Remarque}; Coeff: 1; Fabricant: Texas Instruments; Verification: *; Boitier: SC70_6; ComponentLink1URL: o:\_Documentation\Datasheets\Texas\SN74LVC1G97.pdf; ComponentLink2URL: o:\_Documentation\Datasheets\_Boitiers\ACTIF_CMS\SC\SC70_6_e0,65_(NSC).pdf; Config: *; ComponentLink1Description: Datasheet; ComponentLink2Description: Datasheet Boitier; Ref Fab: SN74LVC1G97DCKR; Supplier 1: Farnell; Supplier 2: Mouser; Supplier Part Number 1: 1470839; Supplier Part Number 2: 595-SN74LVC1G97DCKR

## Sheet SC945D_Alimentations.SchDoc: Alimentations
size 393 x 270 mm; CompanyName: Seccom; Address1: 521, rue du capt. François Garbit; Address2: 69440 Mornant; Address3: seccom@seccom.fr; Address4: www.seccom.fr; DocumentNumber: 3; SheetNumber: 3; SheetTotal: 9; PageSetup: Record=PageOptions|CenterHorizontal=True|CenterVertical=True|PrintScale=0.74|XCorrection=1.00|YCorrection=1.00|PrintKind=0|BorderSize=5000000|LeftOffset=0|BottomOffset=0|Orientation=2|PaperLength=1000|PaperWidth=1000|Scale=100|PaperSource=7|PrintQuality=-4|MediaType=1|DitherType=10|PaperKind=A4|PrintScaleMode=1
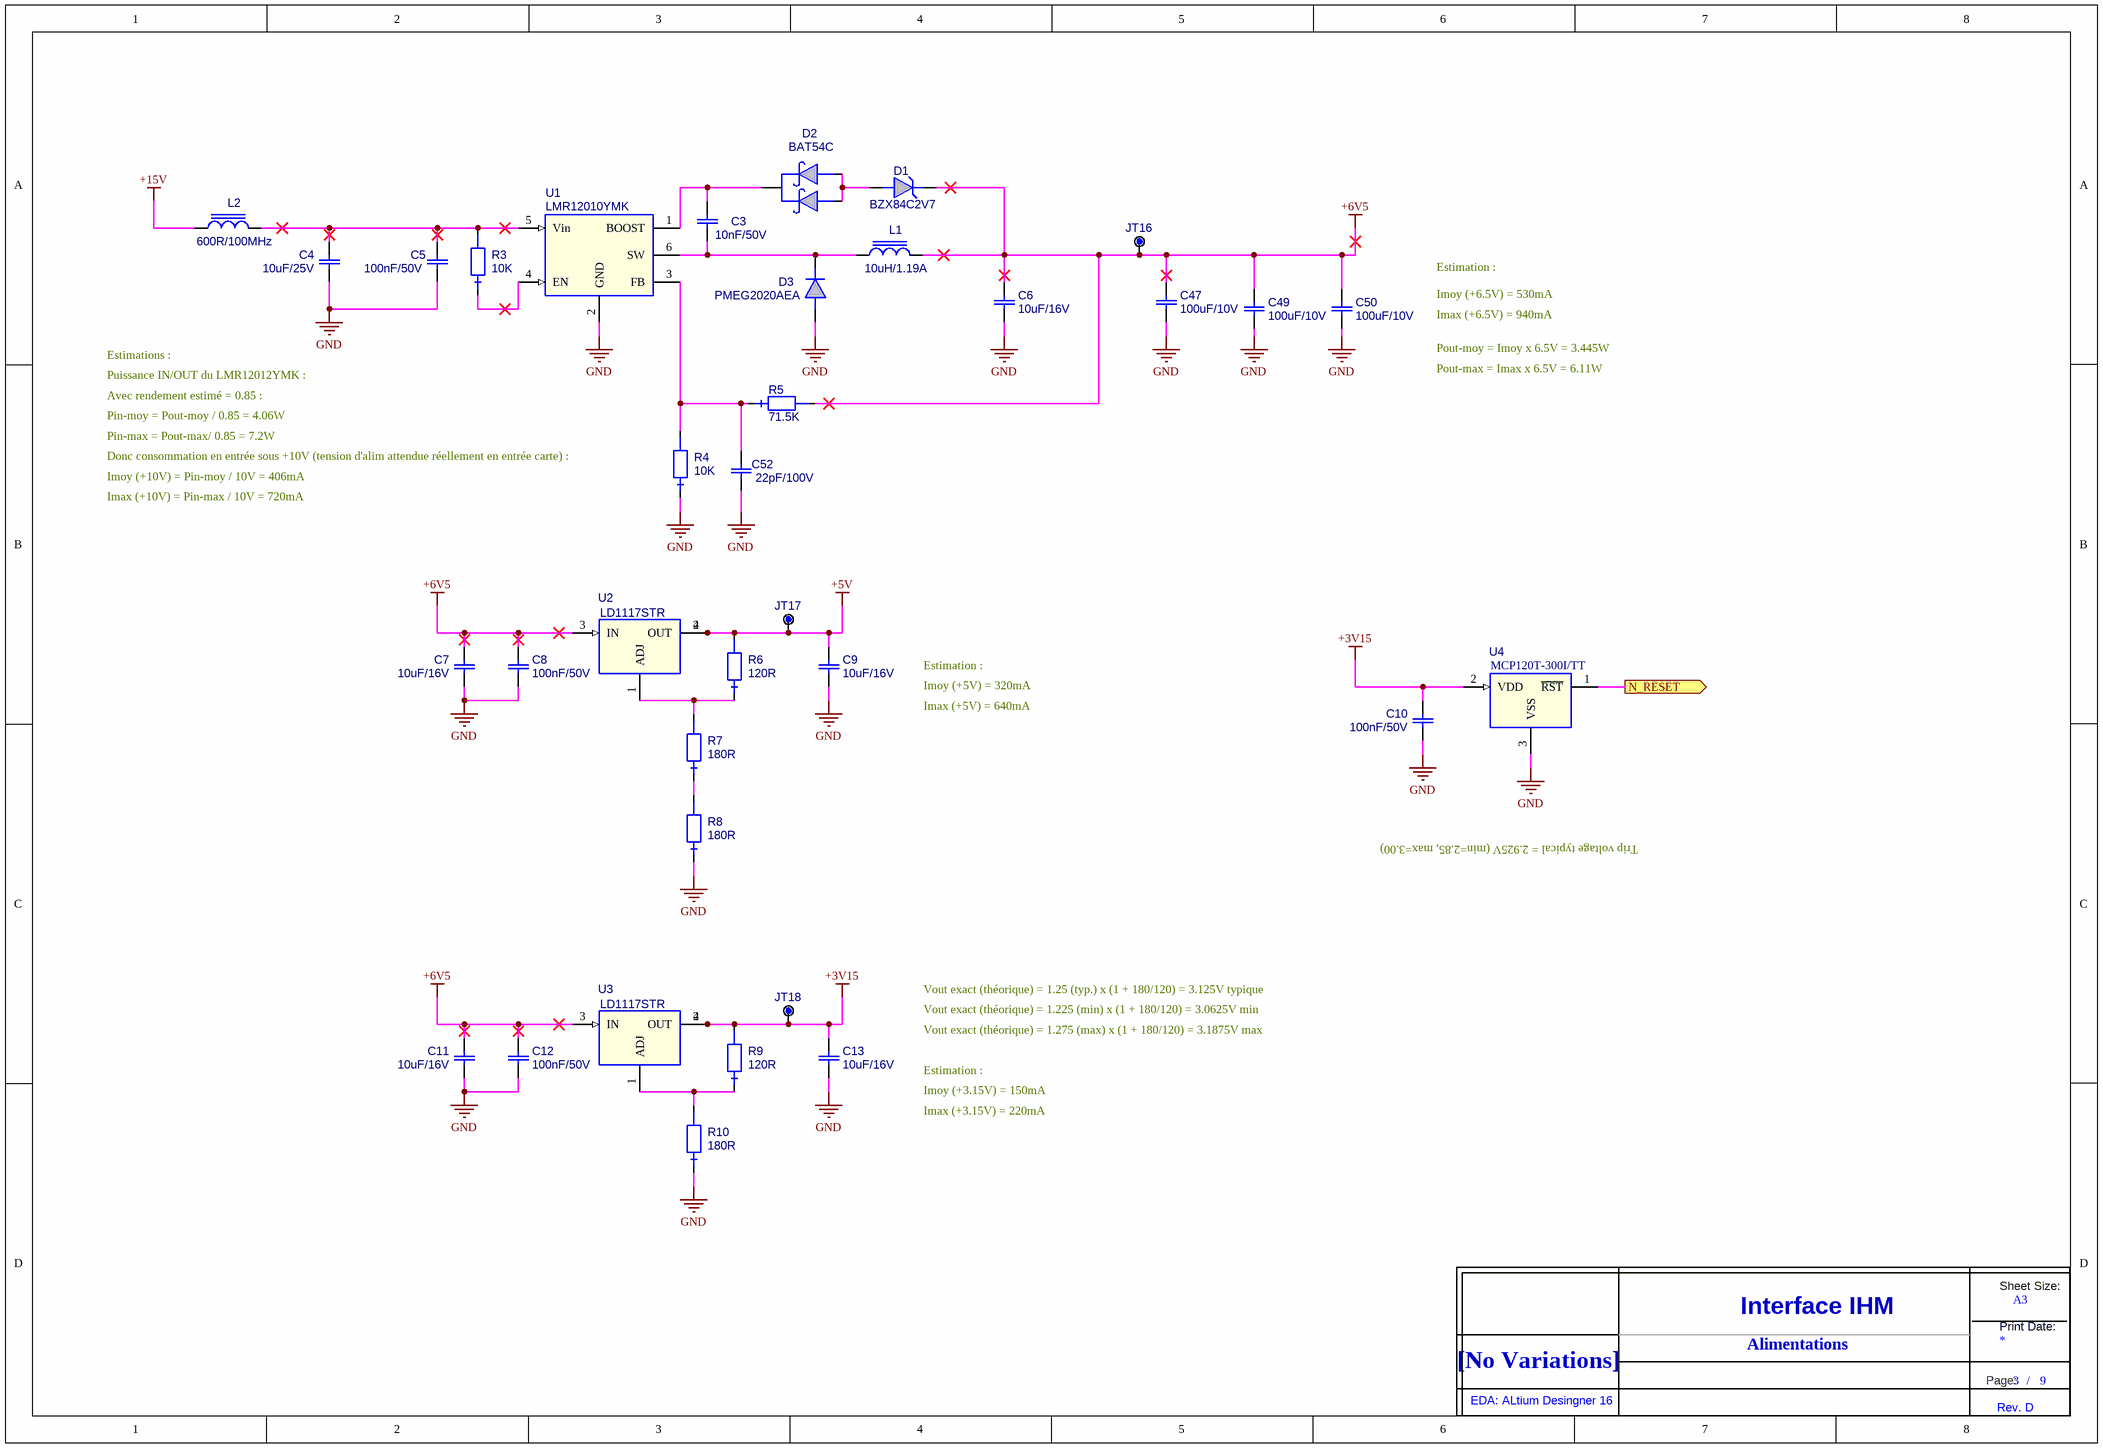
[diagram p2: SC945D_Alimentations.SchDoc]

### Parts
(Parts that share a designator on the sheet are numbered #1, #2 ... from top to bottom, then left to right.)
C3  value 10nF/50V  [0603_ReflowSoldering_CAP]  (hidden comment: C_0603_X7R_10%_10N-50V)
C4  value 10uF/25V  [0805_ReflowSoldering_CAP]  (hidden comment: C_0805_X5R_10%_10U-25V)
C5  value 100nF/50V  [0603_ReflowSoldering_CAP]  (hidden comment: C_0603_X7R_10%_100N-50V)
C6  value 10uF/16V  [0805_ReflowSoldering_CAP]  (hidden comment: C_0805_X5R_10%_10U-16V)
C7  value 10uF/16V  [0805_ReflowSoldering_CAP]  (hidden comment: C_0805_X5R_10%_10U-16V)
C8  value 100nF/50V  [0603_ReflowSoldering_CAP]  (hidden comment: C_0603_X7R_10%_100N-50V)
C9  value 10uF/16V  [0805_ReflowSoldering_CAP]  (hidden comment: C_0805_X5R_10%_10U-16V)
C10  value 100nF/50V  [0603_ReflowSoldering_CAP]  (hidden comment: C_0603_X7R_10%_100N-50V)
C11  value 10uF/16V  [0805_ReflowSoldering_CAP]  (hidden comment: C_0805_X5R_10%_10U-16V)
C12  value 100nF/50V  [0603_ReflowSoldering_CAP]  (hidden comment: C_0603_X7R_10%_100N-50V)
C13  value 10uF/16V  [0805_ReflowSoldering_CAP]  (hidden comment: C_0805_X5R_10%_10U-16V)
C47  value 100uF/10V  [1206_ReflowSoldering_CAP]  (hidden comment: C_1206_X5R_20%_100U-10V)
C49  value 100uF/10V  [1206_ReflowSoldering_CAP]  (hidden comment: C_1206_X5R_20%_100U-10V)
C50  value 100uF/10V  [1206_ReflowSoldering_CAP]  (hidden comment: C_1206_X5R_20%_100U-10V)
C52  value 22pF/100V  [0805_ReflowSoldering_CAP]  (hidden comment: C_0805_NPO_5%_22P-100V)
D1  BZX84C2V7  [SOT23_3L_ReflowSoldering]
D2  BAT54C  [SOT23_3L_ReflowSoldering]
D3  PMEG2020AEA  [SOD323_ReflowSoldering]
JT16  POINT_TEST_PAD_40MIL  [PAD_CMS_40X40_E]  (value not drawn)  (no BOM)
JT17  POINT_TEST_PAD_40MIL  [PAD_CMS_40X40_E]  (value not drawn)  (no BOM)
JT18  POINT_TEST_PAD_40MIL  [PAD_CMS_40X40_E]  (value not drawn)  (no BOM)
L1  value 10uH/1.19A  [SELF_WE-TPC_4.8x4.78_(type4828)]  (hidden comment: SELF_10UH_1.19A_744043100)
L2  value 600R/100MHz  [1206_ReflowSoldering_FERRITE]  (hidden comment: IND_FERRITE_1206_74279218)
R3  value 10K  [0603_ReflowSoldering_RES]  (hidden comment: RES_0603_1%_100PPM_10K)
R4  value 10K  [0603_ReflowSoldering_RES]  (hidden comment: RES_0603_1%_100PPM_10K)
R5  value 71.5K  [0603_ReflowSoldering_RES]  (hidden comment: RES_0603_1%_100PPM_71.5K)
R6  value 120R  [0603_ReflowSoldering_RES]  (hidden comment: RES_0603_1%_100PPM_120R)
R7  value 180R  [0603_ReflowSoldering_RES]  (hidden comment: RES_0603_1%_100PPM_180R)
R8  value 180R  [0603_ReflowSoldering_RES]  (hidden comment: RES_0603_1%_100PPM_180R)
R9  value 120R  [0603_ReflowSoldering_RES]  (hidden comment: RES_0603_1%_100PPM_120R)
R10  value 180R  [0603_ReflowSoldering_RES]  (hidden comment: RES_0603_1%_100PPM_180R)
Title_new?#3  DNI  (value not drawn)  (graphical)
U1  LMR12010YMK  [SOT23_6L]
U2  LD1117STR  [SOT223]
U3  LD1117STR  [SOT223]
U4  MCP120T-300I/TT  [SOT23_3L_ReflowSoldering]

### Ports
N_RESET (out)

### Nets
+3V15: C10.1 C13.2 JT18.1 R9.2 U3.2(OUT) U3.4(OUT) U4.2(VDD)
+5V: C9.2 JT17.1 R6.2 U2.2(OUT) U2.4(OUT)
+6V5: C6.2 C7.2 C8.1 C11.2 C12.1 C47.2 C49.2 C50.2 D1.3 JT16.1 L1.2 R5.2 U2.3(IN) U3.3(IN)
+15V: L2.1
GND: C4.1 C5.2 C6.1 C7.1 C8.2 C9.1 C10.2 C11.1 C12.2 C13.1 C47.1 C49.1 C50.1 C52.1 D3.A R4.1 R8.1 R10.1 U1.2(GND) U4.3(VSS)
N_RESET: U4.1(~{RST}) ; port N_RESET
NetC3_1: C3.1 D3.K L1.1 U1.6(SW)
NetC3_2: C3.2 D2.3 U1.1(BOOST)
NetC4_2: C4.2 C5.1 L2.2 R3.2 U1.5(Vin)
NetC52_2: C52.2 R4.2 R5.1 U1.3(FB)
NetD1_1: D1.1 D2.1 D2.2
NetR3_1: R3.1 U1.4(EN)
NetR6_1: R6.1 R7.2 U2.1(ADJ)
NetR7_1: R7.1 R8.2
NetR9_1: R9.1 R10.2 U3.1(ADJ)

Not connected (* = marked no-connect by the designer): D1 2; L1 3 4 5 6

### Notes on the sheet
- Imoy (+6.5V) = 530mA
- Imax (+6.5V) = 940mA
- Estimation :
- Estimations :
- Puissance IN/OUT du LMR12012YMK :
- Pout-moy = Imoy x 6.5V = 3.445W
- Pout-max = Imax x 6.5V = 6.11W
- Pin-moy = Pout-moy / 0.85 = 4.06W
- Avec rendement estimé = 0.85 :
- Pin-max = Pout-max/ 0.85 = 7.2W
- Imoy (+10V) = Pin-moy / 10V = 406mA
- Imax (+10V) = Pin-max / 10V = 720mA
- (near R4) Donc consommation en entrée sous +10V (tension d'alim attendue réellement en entrée carte) :
- Imoy (+5V) = 320mA
- Imax (+5V) = 640mA
- Trip voltage typical = 2.925V (min=2.85, max=3.00)
- Vout exact (théorique) = 1.25 (typ.) x (1 + 180/120) = 3.125V typique
- Vout exact (théorique) = 1.225 (min) x (1 + 180/120) = 3.0625V min
- Vout exact (théorique) = 1.275 (max) x (1 + 180/120) = 3.1875V max
- Imoy (+3.15V) = 150mA
- Imax (+3.15V) = 220mA
- Alimentations
- (in symbol Title_new) Sheet Size:; A3; Interface IHM; Print Date:; [No Variations]; Page:; /; EDA: ALtium Desingner 16; Rev. D

### Library data of the parts
C3 = C_0603_X7R_10%_10N-50V: Condensateur céramique, X7R, 10%, CMS 0603, 10nF/50V; Creation: FB (01/03/12); Boitier: 0603; Remarque: {Remarque}; Fabricant: Kemet; Ref Fab: C0603C103K5RAC; Coeff: 1; ComponentLink1URL: O:\_Documentation\Datasheets\Kemet\Condos_Ceramic_CMS.pdf; ComponentLink2URL: o:\_Documentation\Datasheets\_BOITIERS\PASSIF_CMS\; Config: *; ComponentLink1Description: Datasheet; ComponentLink2Description: Datasheet Boitier; Supplier 1: Farnell; Supplier 2: RadioSpares; Supplier Part Number 1: 1414609; Supplier Part Number 2: 2644595
C4 = C_0805_X5R_10%_10U-25V: Condensateur céramique, X5R, 10%, CMS 0805, 10uF/25V; Creation: FB (30/07/13); Boitier: 0805; Remarque: {Remarque}; Coeff: 1; Fabricant: Murata; Ref Fab: GRM21BR61E106KA73L; Verification: *; ComponentLink1URL: O:\_Documentation\Datasheets\Murata\Condensateur_GRM21BR61E106KA73.pdf; ComponentLink2URL: o:\_Documentation\Datasheets\_Boitiers\PASSIF_CMS\RC_0805_(2x1,25)_(Schneider).pdf; Config: *; ComponentLink1Description: Datasheet; ComponentLink2Description: Datasheet Boitier; Supplier 1: Farnell; Supplier Part Number 1: 1735530; Supplier 2: Mouser; Supplier Part Number 2: 81-GRM21BR61E106KA3L
C5 C8 C10 C12 = C_0603_X7R_10%_100N-50V: as C21 on sheet SC945D_Interface_BP_et_Prog; ComponentLink1URL: O:\_Documentation\Datasheets\Kemet\Condos_Ceramic_CMS.pdf; ComponentLink2URL: o:\_Documentation\Datasheets\_BOITIERS\PASSIF_CMS\; Config: *; ComponentLink1Description: Datasheet; ComponentLink2Description: Datasheet Boitier; Supplier 1: Farnell; Supplier Part Number 1: 1288255
C6 C7 C9 C11 C13 = C_0805_X5R_10%_10U-16V: Condensateur céramique, X5R, 10%, CMS 0805, 10uF/16V; Creation: FB (02/10/12); Boitier: 0805; Remarque: {Remarque}; Coeff: 1; Fabricant: Kemet; Ref Fab: C0805C106K4PAC; Verification: *; ComponentLink1URL: O:\_Documentation\Datasheets\Kemet\Condos_Ceramic_CMS.pdf; ComponentLink2URL: o:\_Documentation\Datasheets\_Boitiers\PASSIF_CMS\RC_0805_(2x1,25)_(Schneider).pdf; Config: *; ComponentLink1Description: Datasheet; ComponentLink2Description: Datasheet Boitier; Supplier 1: Farnell; Supplier Part Number 1: 1288204; Supplier 2: Mouser; Supplier Part Number 2: 80-C0805C106K4P
C47 C49 C50 = C_1206_X5R_20%_100U-10V: Condensateur céramique, X5R, 20%, CMS 1206, 100uF/10V; Creation: ZA (13/09/13); Boitier: 1206; Remarque: {Remarque}; Fabricant: TDK; Coeff: 1; Ref Fab: C3216X5R1A107M160AC; ComponentLink1URL: O:\_Documentation\Datasheets\TDK\general_B11.pdf; ComponentLink2URL: o:\_Documentation\Datasheets\TDK\Capacitors_MLCC_cseries.pdf; ComponentLink1Description: Datasheet; ComponentLink2Description: Datasheet Boitier; Supplier 1: Farnell; Supplier Part Number 1: 2211193; Supplier 2: Mouser; Supplier Part Number 2: 810-C3216X5R1A107M
C52 = C_0805_NPO_5%_22P-100V: Condensateur céramique, NPO, 5%, CMS 0805; Creation: LJ; Verification: LJ (28/05/04); Boitier: 0805; Remarque: {Remarque}; Coeff: 1; Fabricant: AVX; Ref Fab: 08051A220JAT2A; ComponentLink1URL: o:\_Documentation\Datasheets\BC_Components\Condo_CMS_NPO-X7R-Y5V.pdf; ComponentLink2URL: o:\_Documentation\Datasheets\_BOITIERS\PASSIF_CMS\RC_0805_(2x1,25)_(Schneider).PDF; Config: *; ComponentLink1Description: Datasheet; ComponentLink2Description: Datasheet Boitier; Supplier 1: Farnell; Supplier 2: Mouser; Supplier Part Number 1: 317500; Supplier Part Number 2: 581-08051A220J
D1 = BZX84C2V7: Diode Zener, série BZX84C, 0.3W, +/-5%, 2.7V, CMS; Creation: PDP (10/07/12); Verification: FB (07/09/12); Boitier: SOT23_3L; Remarque: {Remarque}; Coeff: 1; Fabricant: NXP; ComponentLink1URL: o:\_Documentation\Datasheets\NXP\BZX84_SERIES.pdf; ComponentLink2URL: o:\_Documentation\Datasheets\_BOITIERS\ACTIF_CMS\SOT\SOT_23_3P_(Schneider).PDF; Config: *; ComponentLink1Description: Datasheet; ComponentLink2Description: Datasheet Boitier; Ref Fab: BZX84C2V7; Supplier 1: Farnell; Supplier Part Number 1: 1081415; Supplier 2: Mouser; Supplier Part Number 2: 771-BZX84-C2V7-T/R; Value: BZX84C2V7
D2 = BAT54C: as D10 on sheet SC945D_Interface_BP_et_Prog; Verification: LJ (14/05/02); ComponentLink1URL: O:\_Documentation\Datasheets\NXP\BAT54_series.pdf; ComponentLink2URL: o:\_Documentation\Datasheets\_BOITIERS\ACTIF_CMS\SOT\SOT_23_3P_(Schneider).PDF; Config: *; ComponentLink1Description: Datasheet; ComponentLink2Description: Datasheet Boitier; Ref Fab: BAT54C; Supplier 1: Farnell; Supplier Part Number 1: 1081192; Value: BAT54C
D3 = PMEG2020AEA: as D4 on sheet SC945D_Interface_BP_et_Prog; Verification: *; ComponentLink1URL: o:\_Documentation\Datasheets\NXP\PMEG2020AEA.PDF; ComponentLink2URL: o:\_Documentation\Datasheets\_BOITIERS\ACTIF_CMS\SOD\SOD_80_(MLL34)_(Schneider).PDF; Config: *; ComponentLink1Description: Datasheet; ComponentLink2Description: Datasheet Boitier; Ref Fab: PMEG2020AEA; Value: PMEG2020AEA
JT16-JT18 = POINT_TEST_PAD_40MIL: as JT8 on sheet SC945D_Interface_BP_et_Prog; Value: POINT_TEST; Config: *; ComponentLink1Description: Datasheet; ComponentLink2Description: Datasheet Boitier
L1 = SELF_10UH_1.19A_744043100: Inductance bobinée CMS, 10uH +/- 10%, I=1.19A, Rdc=0.095R, SRF=40MHz, -40/+85°C; Creation: LJ (02/08/12); Boitier: 4.8x4.8_h2.8mm; Coeff: 1; Fabricant: Wurth Elektronik; Verification: *; ComponentLink1URL: O:\_Documentation\Datasheets\Wurth_Elektronik\744043100.pdf; ComponentLink2URL: O:\_Documentation\Datasheets\Wurth_Elektronik\744043100.pdf; Remarque: *; Config: *; ComponentLink1Description: Datasheet; ComponentLink2Description: Datasheet Boitier; Ref Fab: 744043100
L2 = IND_FERRITE_1206_74279218: Inductance à ferrite multicouches CMS, imp=600R@100MHz, +/-25%, Rdc=100mR, I=2A; Creation: LJ (12/08/08); Reference: 000049/00; Boitier: 1206; Remarque: Alternative aux selfs de choc; Coeff: 1; Fabricant: Wurth Elektronik; Verification: *; ComponentLink1URL: o:\_Documentation\Datasheets\Wurth_Elektronik\74279218.pdf; ComponentLink2URL: o:\_Documentation\Datasheets\_Boitiers\PASSIF_CMS\RC_1206_(3,2x1,6)_(Schneider).pdf; Config: *; ComponentLink1Description: Datasheet; ComponentLink2Description: Datasheet Boitier; Ref Fab: 74279218
R3 R4 = RES_0603_1%_100PPM_10K: as R26 on sheet SC945D_Interface_BP_et_Prog; Verification: *; ComponentLink1URL: O:\_Documentation\Datasheets\Vishay\Resistances_D-CRCWe3.pdf; ComponentLink2URL: o:\_Documentation\Datasheets\_BOITIERS\PASSIF_CMS\; Config: *; ComponentLink1Description: Datasheet; ComponentLink2Description: Datasheet Boitier; Supplier 1: Farnell; Supplier 2: RadioSpares; Supplier Part Number 1: 1469748; Supplier Part Number 2: 6789667
R5 = RES_0603_1%_100PPM_71.5K: Résistance, 0.100W, 1%, 100ppm, 75V, 71.5K; Creation: FB (07/09/12); Boitier: 0603; Remarque: {Remarque}; Fabricant: Vishay; Ref Fab: CRCW060371K5FKEA; Coeff: 1; Verification: *; ComponentLink1URL: O:\_Documentation\Datasheets\Vishay\Resistances_D-CRCWe3.pdf; ComponentLink2URL: o:\_Documentation\Datasheets\_BOITIERS\PASSIF_CMS\; Config: *; ComponentLink1Description: Datasheet; ComponentLink2Description: Datasheet Boitier; Supplier 1: Farnell; Supplier Part Number 1: 1469837; Supplier 2: Mouser; Supplier Part Number 2: 71-CRCW0603-71.5K-E3
R6 R9 = RES_0603_1%_100PPM_120R: Résistance, 0.100W, 1%, 100ppm, 75V, 120R; Creation: FB (07/09/12); Boitier: 0603; Remarque: {Remarque}; Fabricant: Vishay; Ref Fab: CRCW0603120RFKEA; Coeff: 1; Verification: *; ComponentLink1URL: O:\_Documentation\Datasheets\Vishay\Resistances_D-CRCWe3.pdf; ComponentLink2URL: o:\_Documentation\Datasheets\_BOITIERS\PASSIF_CMS\; Config: *; ComponentLink1Description: Datasheet; ComponentLink2Description: Datasheet Boitier; Supplier 1: Farnell; Supplier Part Number 1: 1652832; Supplier 2: Mouser; Supplier Part Number 2: 71-CRCW0603-120-E3
R7 R8 R10 = RES_0603_1%_100PPM_180R: Résistance, 0.100W, 1%, 100ppm, 75V, 180R; Creation: FB (06/09/12); Boitier: 0603; Remarque: {Remarque}; Fabricant: Vishay; Ref Fab: CRCW0603180RFKEA; Coeff: 1; Verification: *; ComponentLink1URL: O:\_Documentation\Datasheets\Vishay\Resistances_D-CRCWe3.pdf; ComponentLink2URL: o:\_Documentation\Datasheets\_BOITIERS\PASSIF_CMS\; Config: *; ComponentLink1Description: Datasheet; ComponentLink2Description: Datasheet Boitier; Supplier 1: Farnell; Supplier Part Number 1: 1469762; Supplier 2: Mouser; Supplier Part Number 2: 71-CRCW0603-180-E3
Title_new?#3 = Title_new
U1 = LMR12010YMK: Régulateur ajustable step down, 0.8~20V, 1A, Vin=3~20V, -40/+125°C, CMS; Creation: PDP (10/07/12); Verification: LJ (02/08/12); Boitier: TSOT-6; Remarque: {Remarque}; Coeff: 1; Fabricant: National Semiconductor; ComponentLink1URL: O:\_Documentation\Datasheets\National_SemiConductors\LMR12010.pdf; ComponentLink2URL: o:\_Documentation\Datasheets\_Boitiers\ACTIF_CMS\; ComponentLink1Description: Datasheet; ComponentLink2Description: Datasheet Boitier; Ref Fab: LMR12010YMK; Supplier 1: Farnell; Supplier Part Number 1: 2060645; Supplier 2: Mouser; Supplier Part Number 2: 926-LMR12010YMKENOPB; Value: LMR12010YMK
U2 U3 = LD1117STR: Régulateur de tension ajustable positif, 1.25~15V, 0.8A, LDO (1V), Vin=15Vmax, CMS; Creation: FB (07/09/12); Remarque: {Remarque}; Coeff: 1; Fabricant: ST; Boitier: SOT223; ComponentLink2URL: o:\_Documentation\Datasheets\_Boitiers\ACTIF_CMS\SOT & TSOT\SOT223_4_(Schneider).pdf; Config: *; ComponentLink1URL: o:\_Documentation\Datasheets\ST\LD1117.pdf; ComponentLink1Description: Datasheet; ComponentLink2Description: Datasheet Boitier; Ref Fab: LD1117STR; Value: LD1117STR
U4 = MCP120T-300I/TT: Microcontroller Supervisory Circuit with Open Drain Output, Active Low, 2.925V trip point; Creation: PDP (10/07/2012); Verification: FB (11/09/12); Boitier: SOT23_3L; Remarque: {Remarque}; Coeff: 1; Fabricant: Microchip; Config: *; ComponentLink1Description: Datasheet; ComponentLink1URL: o:\_Documentation\Datasheets\MicroChip\MCP120.pdf; ComponentLink2Description: Datasheet Boitier; ComponentLink2URL: o:\_Documentation\Datasheets\_Boitiers\ACTIF_CMS\SOT & TSOT\SOT23_3_(Schneider).pdf; Supplier 1: Farnell; Supplier Part Number 1: 1292233; Supplier 2: Mouser; Supplier Part Number 2: 579-MCP120T-300I/TT; Ref Fab: MCP120T-300I/TT; Value: MCP120T-300I/TT

## Sheet SC945D_Micro.SchDoc: Micro
size 393 x 270 mm; CompanyName: Seccom; Address1: 521, rue du capt. François Garbit; Address2: 69440 Mornant; Address3: seccom@seccom.fr; Address4: www.seccom.fr; DocumentNumber: 4; SheetNumber: 4; SheetTotal: 9; PageSetup: Record=PageOptions|CenterHorizontal=True|CenterVertical=True|PrintScale=0.74|XCorrection=1.00|YCorrection=1.00|PrintKind=0|BorderSize=5000000|LeftOffset=0|BottomOffset=0|Orientation=2|PaperLength=1000|PaperWidth=1000|Scale=100|PaperSource=7|PrintQuality=-4|MediaType=1|DitherType=10|PaperKind=A4|PrintScaleMode=1
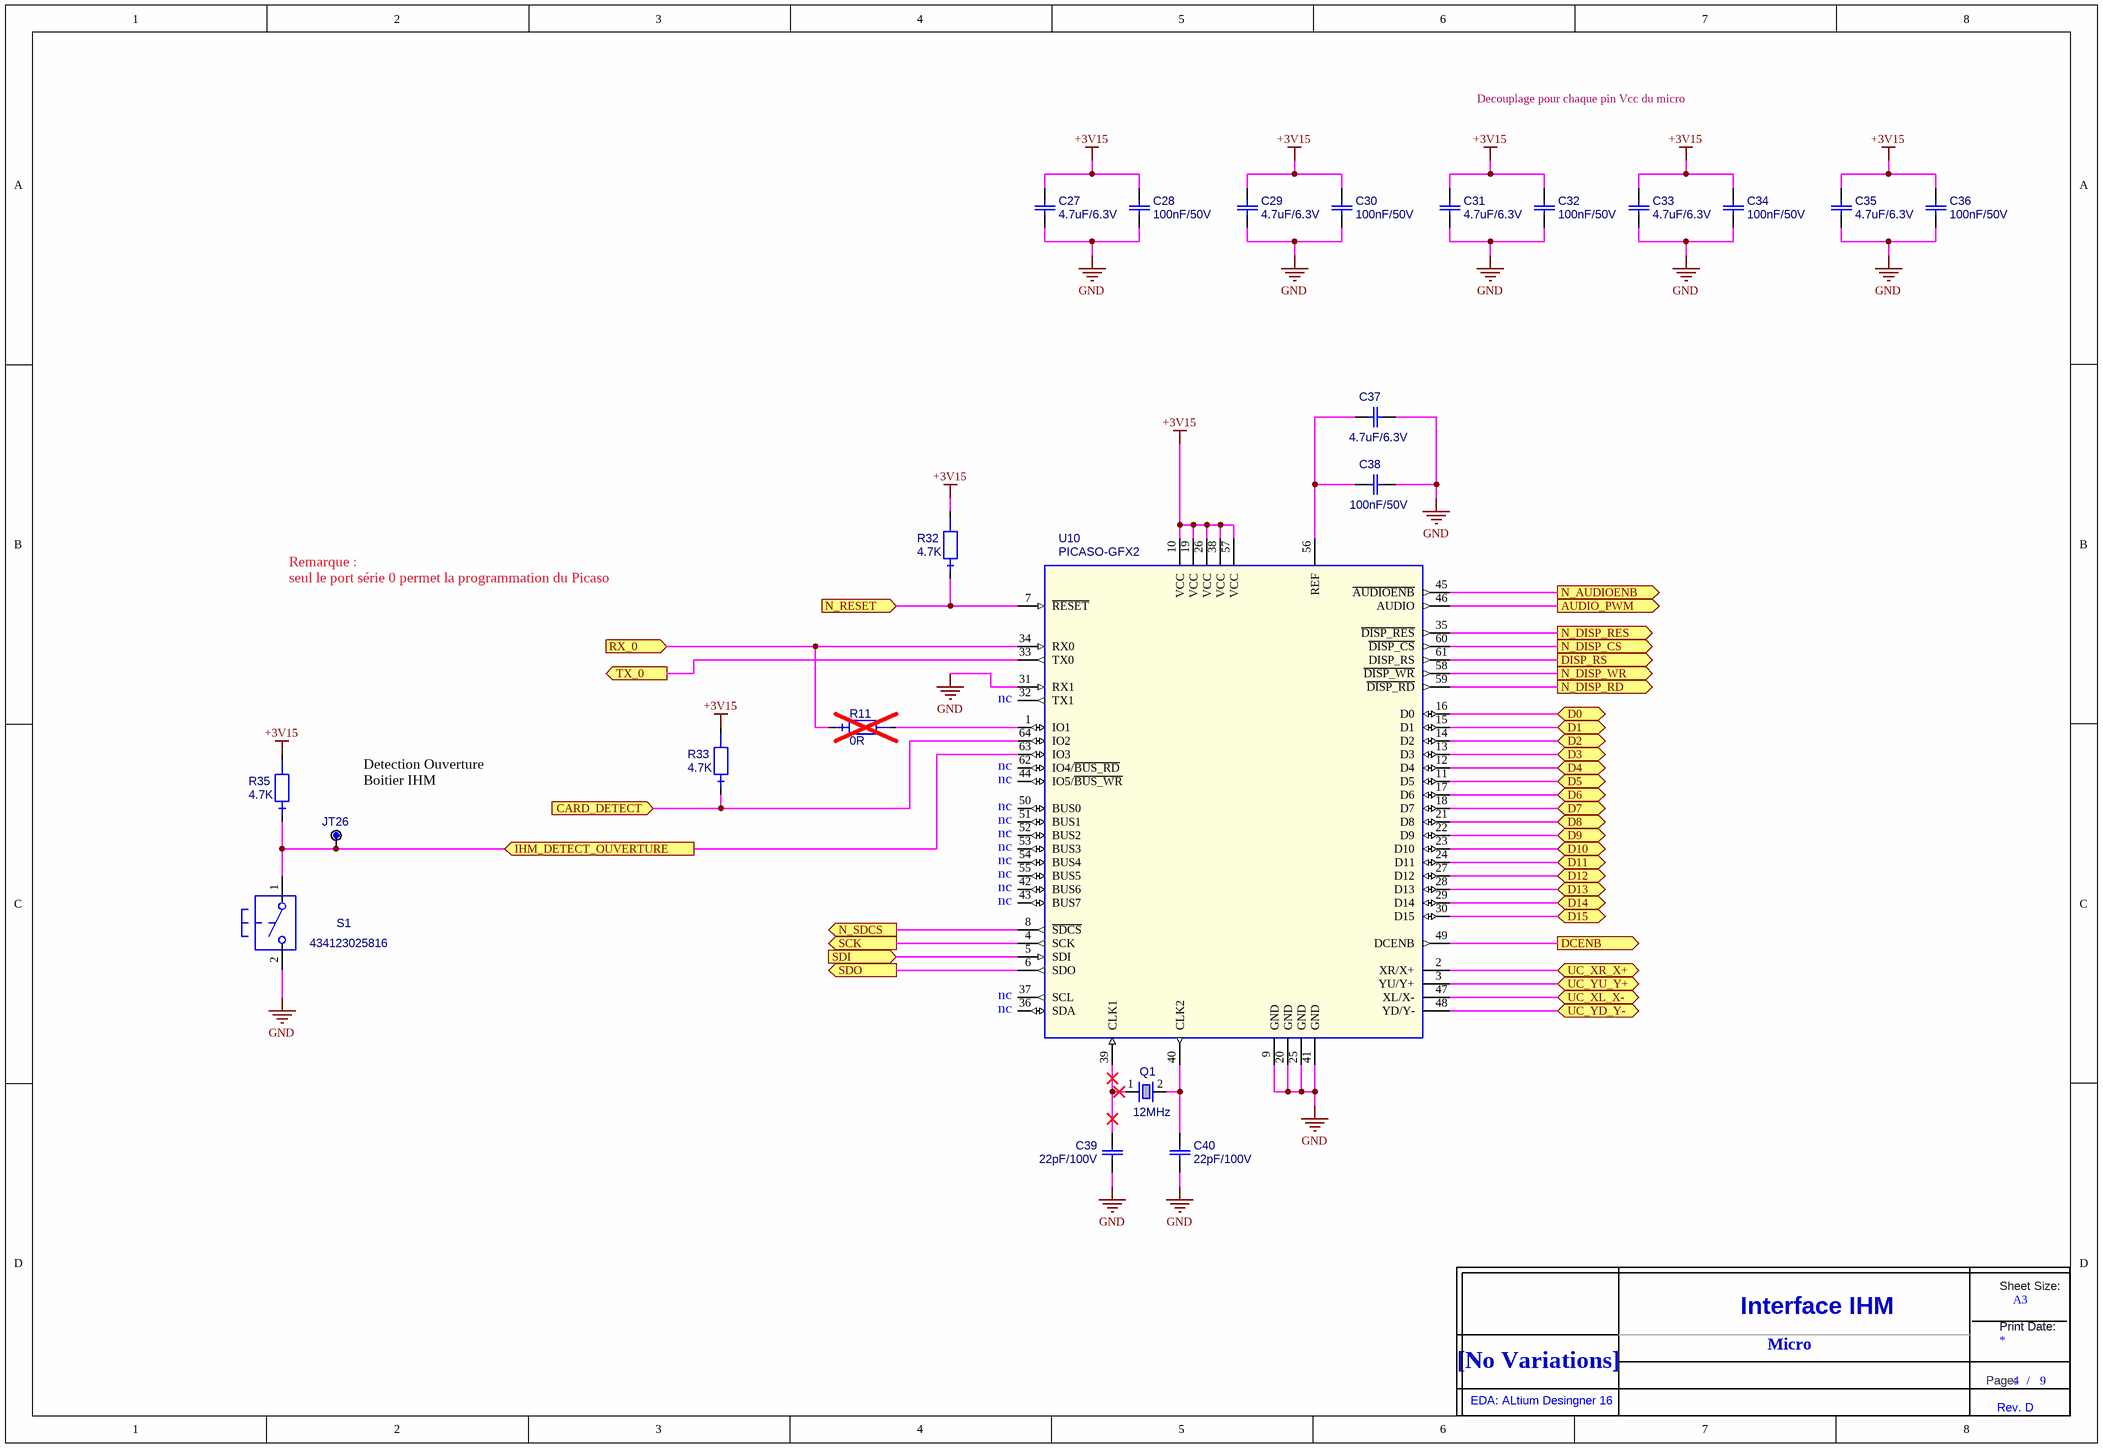
[diagram p3: SC945D_Micro.SchDoc]

### Parts
(Parts that share a designator on the sheet are numbered #1, #2 ... from top to bottom, then left to right.)
C27  value 4.7uF/6.3V  [0603_ReflowSoldering_CAP]  (hidden comment: C_0603_X5R_10%_4.7U-6.3V)
C28  value 100nF/50V  [0603_ReflowSoldering_CAP]  (hidden comment: C_0603_X7R_10%_100N-50V)
C29  value 4.7uF/6.3V  [0603_ReflowSoldering_CAP]  (hidden comment: C_0603_X5R_10%_4.7U-6.3V)
C30  value 100nF/50V  [0603_ReflowSoldering_CAP]  (hidden comment: C_0603_X7R_10%_100N-50V)
C31  value 4.7uF/6.3V  [0603_ReflowSoldering_CAP]  (hidden comment: C_0603_X5R_10%_4.7U-6.3V)
C32  value 100nF/50V  [0603_ReflowSoldering_CAP]  (hidden comment: C_0603_X7R_10%_100N-50V)
C33  value 4.7uF/6.3V  [0603_ReflowSoldering_CAP]  (hidden comment: C_0603_X5R_10%_4.7U-6.3V)
C34  value 100nF/50V  [0603_ReflowSoldering_CAP]  (hidden comment: C_0603_X7R_10%_100N-50V)
C35  value 4.7uF/6.3V  [0603_ReflowSoldering_CAP]  (hidden comment: C_0603_X5R_10%_4.7U-6.3V)
C36  value 100nF/50V  [0603_ReflowSoldering_CAP]  (hidden comment: C_0603_X7R_10%_100N-50V)
C37  value 4.7uF/6.3V  [0603_ReflowSoldering_CAP]  (hidden comment: C_0603_X5R_10%_4.7U-6.3V)
C38  value 100nF/50V  [0603_ReflowSoldering_CAP]  (hidden comment: C_0603_X7R_10%_100N-50V)
C39  value 22pF/100V  [0805_ReflowSoldering_CAP]  (hidden comment: C_0805_NPO_5%_22P-100V)
C40  value 22pF/100V  [0805_ReflowSoldering_CAP]  (hidden comment: C_0805_NPO_5%_22P-100V)
JT26  POINT_TEST_PAD_40MIL  [PAD_CMS_40X40_E]  (value not drawn)  (no BOM)
Q1  value 12MHz  [QUARTZ_HC49_11.5X5_CMS]  (hidden comment: QUARTZ_HC49/4HSMX_12M)
R11  value 0R  [0603_ReflowSoldering_RES]  (hidden comment: RES_0603_1%_100PPM_0R)  (no BOM)
R32  value 4.7K  [0603_ReflowSoldering_RES]  (hidden comment: RES_0603_1%_100PPM_4.7K)
R33  value 4.7K  [0603_ReflowSoldering_RES]  (hidden comment: RES_0603_1%_100PPM_4.7K)
R35  value 4.7K  [0603_ReflowSoldering_RES]  (hidden comment: RES_0603_1%_100PPM_4.7K)
S1  value 434123025816  [SWITCH_ON_MOM_WS_TRS_CMS]  (hidden comment: INTP_D_1C-1P_ON-MOM_434123025816)
Title_new?#4  DNI  (value not drawn)  (graphical)
U10  PICASO-GFX2  [QFP_064_E0,50_10X10MM]

### Ports
AUDIO_PWM (out), CARD_DETECT (in), D0 (bidir), D1 (bidir), D2 (bidir), D3 (bidir), D4 (bidir), D5 (bidir), D6 (bidir), D7 (bidir), D8 (bidir), D9 (bidir), D10 (bidir), D11 (bidir), D12 (bidir), D13 (bidir), D14 (bidir), D15 (bidir), DCENB (out), DISP_RS (out), IHM_DETECT_OUVERTURE (in), N_AUDIOENB (out), N_DISP_CS (out), N_DISP_RD (out), N_DISP_RES (out), N_DISP_WR (out), N_RESET (in), N_SDCS (out), RX_0 (in), SCK (out), SDI (in), SDO (out), TX_0 (out), UC_XL_X- (bidir), UC_XR_X+ (bidir), UC_YD_Y- (bidir), UC_YU_Y+ (bidir)

### Nets
+3V15: C27.2 C28.2 C29.2 C30.2 C31.2 C32.2 C33.2 C34.2 C35.2 C36.2 R32.2 R33.2 R35.2 U10.10(VCC) U10.19(VCC) U10.26(VCC) U10.38(VCC) U10.57(VCC)
GND: C27.1 C28.1 C29.1 C30.1 C31.1 C32.1 C33.1 C34.1 C35.1 C36.1 C37.1 C38.1 C39.1 C40.1 S1.2 U10.9(GND) U10.20(GND) U10.25(GND) U10.31(RX1) U10.41(GND)
AUDIO_PWM: U10.46(AUDIO) ; port AUDIO_PWM
CARD_DETECT: R33.1 U10.64(IO2) ; port CARD_DETECT
D0: U10.16(D0) ; port D0
D1: U10.15(D1) ; port D1
D2: U10.14(D2) ; port D2
D3: U10.13(D3) ; port D3
D4: U10.12(D4) ; port D4
D5: U10.11(D5) ; port D5
D6: U10.17(D6) ; port D6
D7: U10.18(D7) ; port D7
D8: U10.21(D8) ; port D8
D9: U10.22(D9) ; port D9
D10: U10.23(D10) ; port D10
D11: U10.24(D11) ; port D11
D12: U10.27(D12) ; port D12
D13: U10.28(D13) ; port D13
D14: U10.29(D14) ; port D14
D15: U10.30(D15) ; port D15
DCENB: U10.49(DCENB) ; port DCENB
DISP_RS: U10.61(DISP_RS) ; port DISP_RS
IHM_DETECT_OUVERTURE: JT26.1 R35.1 S1.1 U10.63(IO3) ; port IHM_DETECT_OUVERTURE
N_AUDIOENB: U10.45(~{AUDIOENB}) ; port N_AUDIOENB
N_DISP_CS: U10.60(~{DISP_CS}) ; port N_DISP_CS
N_DISP_RD: U10.59(~{DISP_RD}) ; port N_DISP_RD
N_DISP_RES: U10.35(~{DISP_RES}) ; port N_DISP_RES
N_DISP_WR: U10.58(~{DISP_WR}) ; port N_DISP_WR
N_RESET: R32.1 U10.7(~{RESET}) ; port N_RESET
N_SDCS: U10.8(~{SDCS}) ; port N_SDCS
RX_0: R11.1 U10.34(RX0) ; port RX_0
SCK: U10.4(SCK) ; port SCK
SDI: U10.5(SDI) ; port SDI
SDO: U10.6(SDO) ; port SDO
TX_0: U10.33(TX0) ; port TX_0
UC_XL_X-: U10.47(XL/X-) ; port UC_XL_X-
UC_XR_X+: U10.2(XR/X+) ; port UC_XR_X+
UC_YD_Y-: U10.48(YD/Y-) ; port UC_YD_Y-
UC_YU_Y+: U10.3(YU/Y+) ; port UC_YU_Y+
NetC37_2: C37.2 C38.2 U10.56(REF)
NetC39_2: C39.2 Q1.1 U10.39(CLK1)
NetC40_2: C40.2 Q1.2 U10.40(CLK2)
NetR11_2: R11.2 U10.1(IO1)

Not connected (* = marked no-connect by the designer): U10 32(TX1) 36(SDA) 37(SCL) 42(BUS6) 43(BUS7) 44(IO5/~{BUS_WR}) 50(BUS0) 51(BUS1) 52(BUS2) 53(BUS3) 54(BUS4) 55(BUS5) 62(IO4/~{BUS_RD})

### Notes on the sheet
- Decouplage pour chaque pin Vcc du micro
- Remarque :
  seul le port série 0 permet la programmation du Picaso
- (near U10) nc
- (near JT26) Detection Ouverture
  Boitier IHM
- Micro
- (in symbol Title_new) Sheet Size:; A3; Interface IHM; Print Date:; [No Variations]; Page:; /; EDA: ALtium Desingner 16; Rev. D

### Library data of the parts
C27 C29 C31 C33 C35 C37 = C_0603_X5R_10%_4.7U-6.3V: Condensateur céramique, X5R, 10%, CMS 0603, 4.7uF/6.3V; Creation: FB (29/02/12); Boitier: 0603; Remarque: {Remarque}; Fabricant: Kemet; Ref Fab: C0603C475K9PAC; Coeff: 1; ComponentLink1URL: O:\_Documentation\Datasheets\Kemet\Condos_Ceramic_X5R.pdf; ComponentLink2URL: o:\_Documentation\Datasheets\_BOITIERS\PASSIF_CMS\; Config: *; ComponentLink1Description: Datasheet; ComponentLink2Description: Datasheet Boitier; Supplier 1: Farnell; Supplier 2: RadioSpares; Supplier Part Number 1: 9227784; Supplier Part Number 2: 6911164
C28 C30 C32 C34 C36 C38 = C_0603_X7R_10%_100N-50V: as C21 on sheet SC945D_Interface_BP_et_Prog; ComponentLink1URL: O:\_Documentation\Datasheets\Kemet\Condos_Ceramic_CMS.pdf; ComponentLink2URL: o:\_Documentation\Datasheets\_BOITIERS\PASSIF_CMS\; Config: *; ComponentLink1Description: Datasheet; ComponentLink2Description: Datasheet Boitier; Supplier 1: Farnell; Supplier Part Number 1: 1288255
C39 C40 = C_0805_NPO_5%_22P-100V: as C52 on sheet SC945D_Alimentations; ComponentLink1URL: o:\_Documentation\Datasheets\BC_Components\Condo_CMS_NPO-X7R-Y5V.pdf; ComponentLink2URL: o:\_Documentation\Datasheets\_BOITIERS\PASSIF_CMS\RC_0805_(2x1,25)_(Schneider).PDF; Config: *; ComponentLink1Description: Datasheet; ComponentLink2Description: Datasheet Boitier; Supplier 1: Farnell; Supplier 2: Mouser; Supplier Part Number 1: 317500; Supplier Part Number 2: 581-08051A220J
JT26 = POINT_TEST_PAD_40MIL: as JT8 on sheet SC945D_Interface_BP_et_Prog; Value: POINT_TEST; Config: *; ComponentLink1Description: Datasheet; ComponentLink2Description: Datasheet Boitier
Q1 = QUARTZ_HC49/4HSMX_12M: Quartz CMS série HCM49 (équiv HC49/US), -10/+60°C, +/-30ppm, 18pF; Creation: FB (11/09/12); Fabricant: Citizen; Ref Fab: HCM49 12.000MABJ-UT; Coeff: 1; Verification: *; Boitier: HC49/4HSMX; Remarque: *; ComponentLink1URL: O:\_Documentation\Datasheets\Citizen\Quartz_HC49-US_HCM49.pdf; ComponentLink2URL: o:\_Documentation\Datasheets\_BOITIERS\; Config: *; ComponentLink1Description: Datasheet; ComponentLink2Description: Datasheet Boitier; Supplier 1: Farnell; Supplier Part Number 1: 1652567; Supplier 2: Mouser; Supplier Part Number 2: 695-HCM49-12-U
R11 = RES_0603_1%_100PPM_0R: Résistance, 0.100W, 1%, 100ppm, 75V, 0R; Creation: FB (04/07/12); Boitier: 0603; Remarque: {Remarque}; Fabricant: Vishay; Ref Fab: CRCW06030000Z0EA; Coeff: 1; Verification: *; ComponentLink1URL: O:\_Documentation\Datasheets\Vishay\Resistances_D-CRCWe3.pdf; ComponentLink2URL: o:\_Documentation\Datasheets\_BOITIERS\PASSIF_CMS\; Config: *; ComponentLink1Description: Datasheet; ComponentLink2Description: Datasheet Boitier; Supplier 1: Farnell; Supplier Part Number 1: 1469739
R32 R33 R35 = RES_0603_1%_100PPM_4.7K: as R30 on sheet SC945D_Interface_BP_et_Prog; Verification: *; ComponentLink1URL: O:\_Documentation\Datasheets\Vishay\Resistances_D-CRCWe3.pdf; ComponentLink2URL: o:\_Documentation\Datasheets\_BOITIERS\PASSIF_CMS\; Config: *; ComponentLink1Description: Datasheet; ComponentLink2Description: Datasheet Boitier; Supplier 1: Farnell; Supplier 2: RadioSpares; Supplier Part Number 1: 1469807; Supplier Part Number 2: 6790484
S1 = INTP_D_1C-1P_ON-MOM_434123025816: Bouton poussoir, CI, 1 circuit, ON/MOM, droit, tactile, 50mA/12V, -40/+85°C, noir, CMS; Creation: FB (31/07/13); Boitier: WS-TRS_6x3.8_h1.7_Db1.9_Hb2.5mm; Remarque: {Remarque}; Coeff: 1; Fabricant: Wurth Elektronik; Verification: *; ComponentLink1URL: O:\_Documentation\Datasheets\Wurth_Elektronik\434123025816.pdf; Config: *; ComponentLink1Description: Datasheet; ComponentLink2Description: Datasheet Boitier; Ref Fab: 434123025816; Supplier 1: Farnell; Supplier Part Number 1: 1867993
Title_new?#4 = Title_new
U10 = PICASO-GFX2: Contrôleur ASIC graphique & audio 4DGL intégré, pour écrans OLED/LCD/TFT couleurs tactiles, 16bits, CMS; Creation: FB (28/02/2012); Verification: LJ (25/06/12); Boitier: QFP64_e0.50_10x10mm; Remarque: {Remarque}; Fabricant: 4D Systems; Coeff: 1; Ref Fab: PICASO-GFX2; Config: *; ComponentLink1Description: Datasheet; ComponentLink1URL: O:\_Documentation\Datasheets\4D_Systems\PICASO-GFX2-DS-rev4.pdf; ComponentLink2Description: Datasheet Boitier; ComponentLink2URL: o:\_Documentation\Datasheets\_Boitiers\ACTIF_CMS\QFP\QFP_064_e0,50_10x10mm_(Schneider).PDF; Value: PICASO-GFX2